# EasyEDA Pro project CameraTargetF4V1.eprj, board PCB1
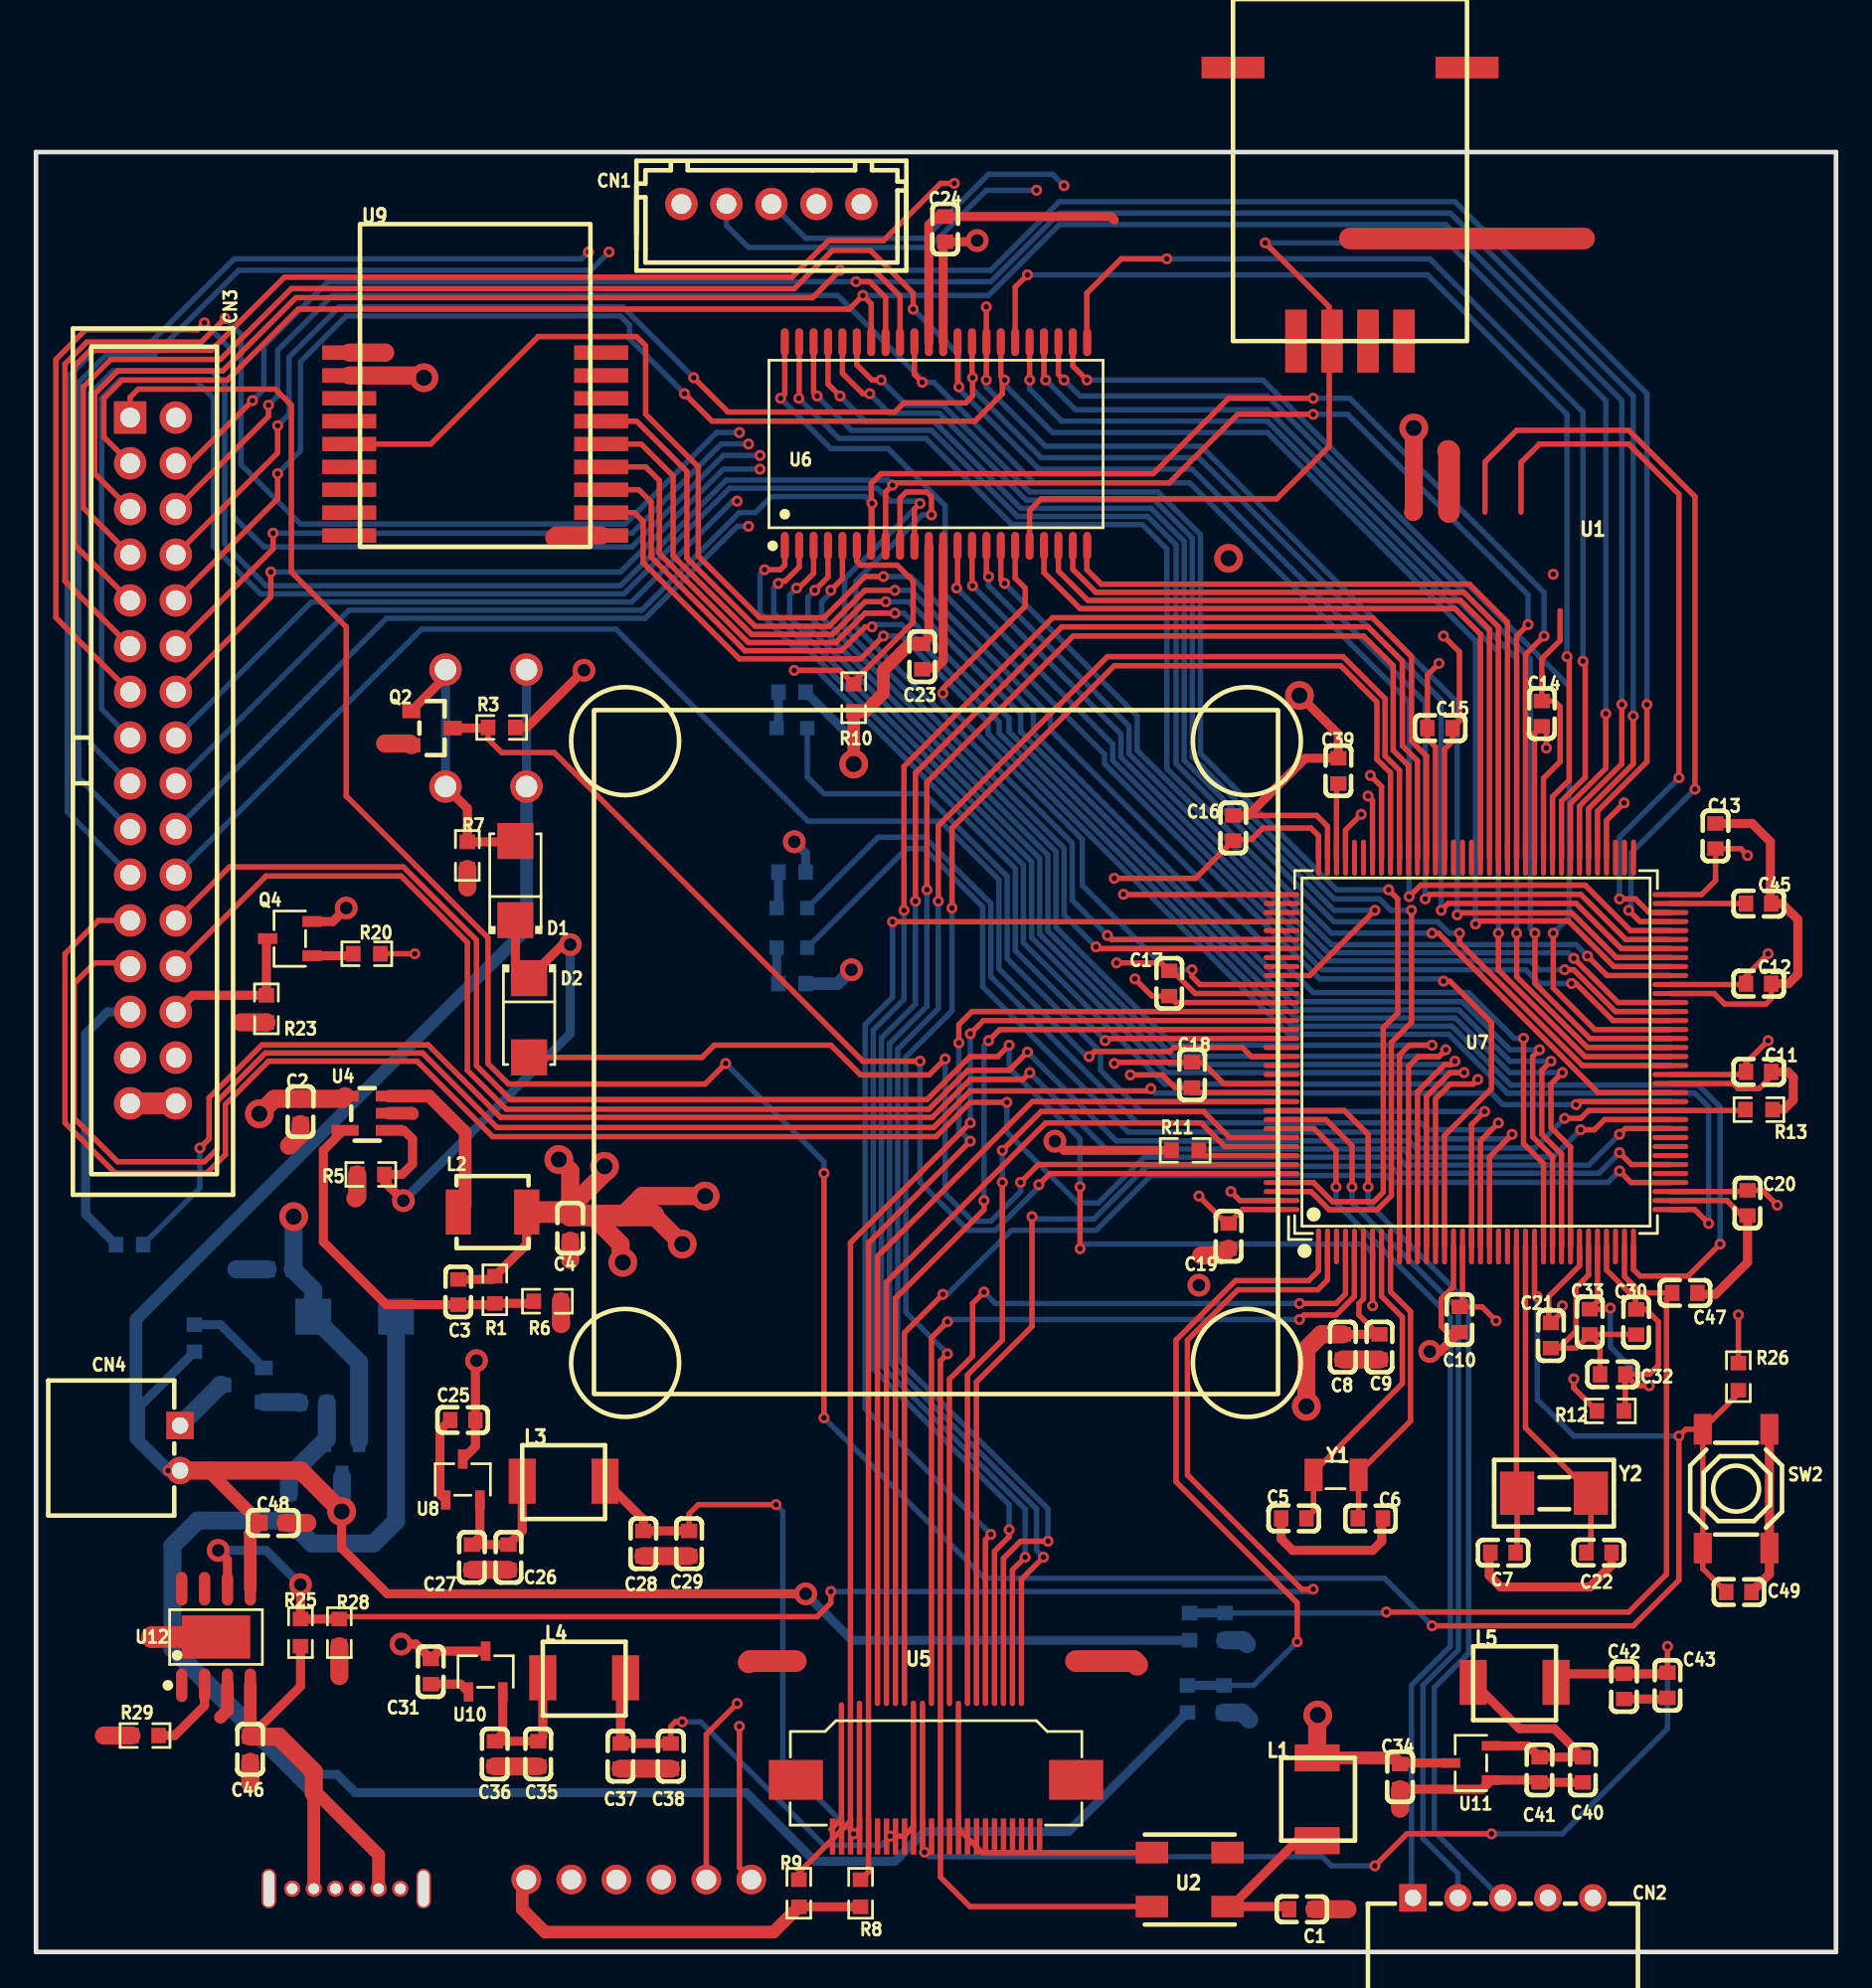
[diagram p1: board, top side]
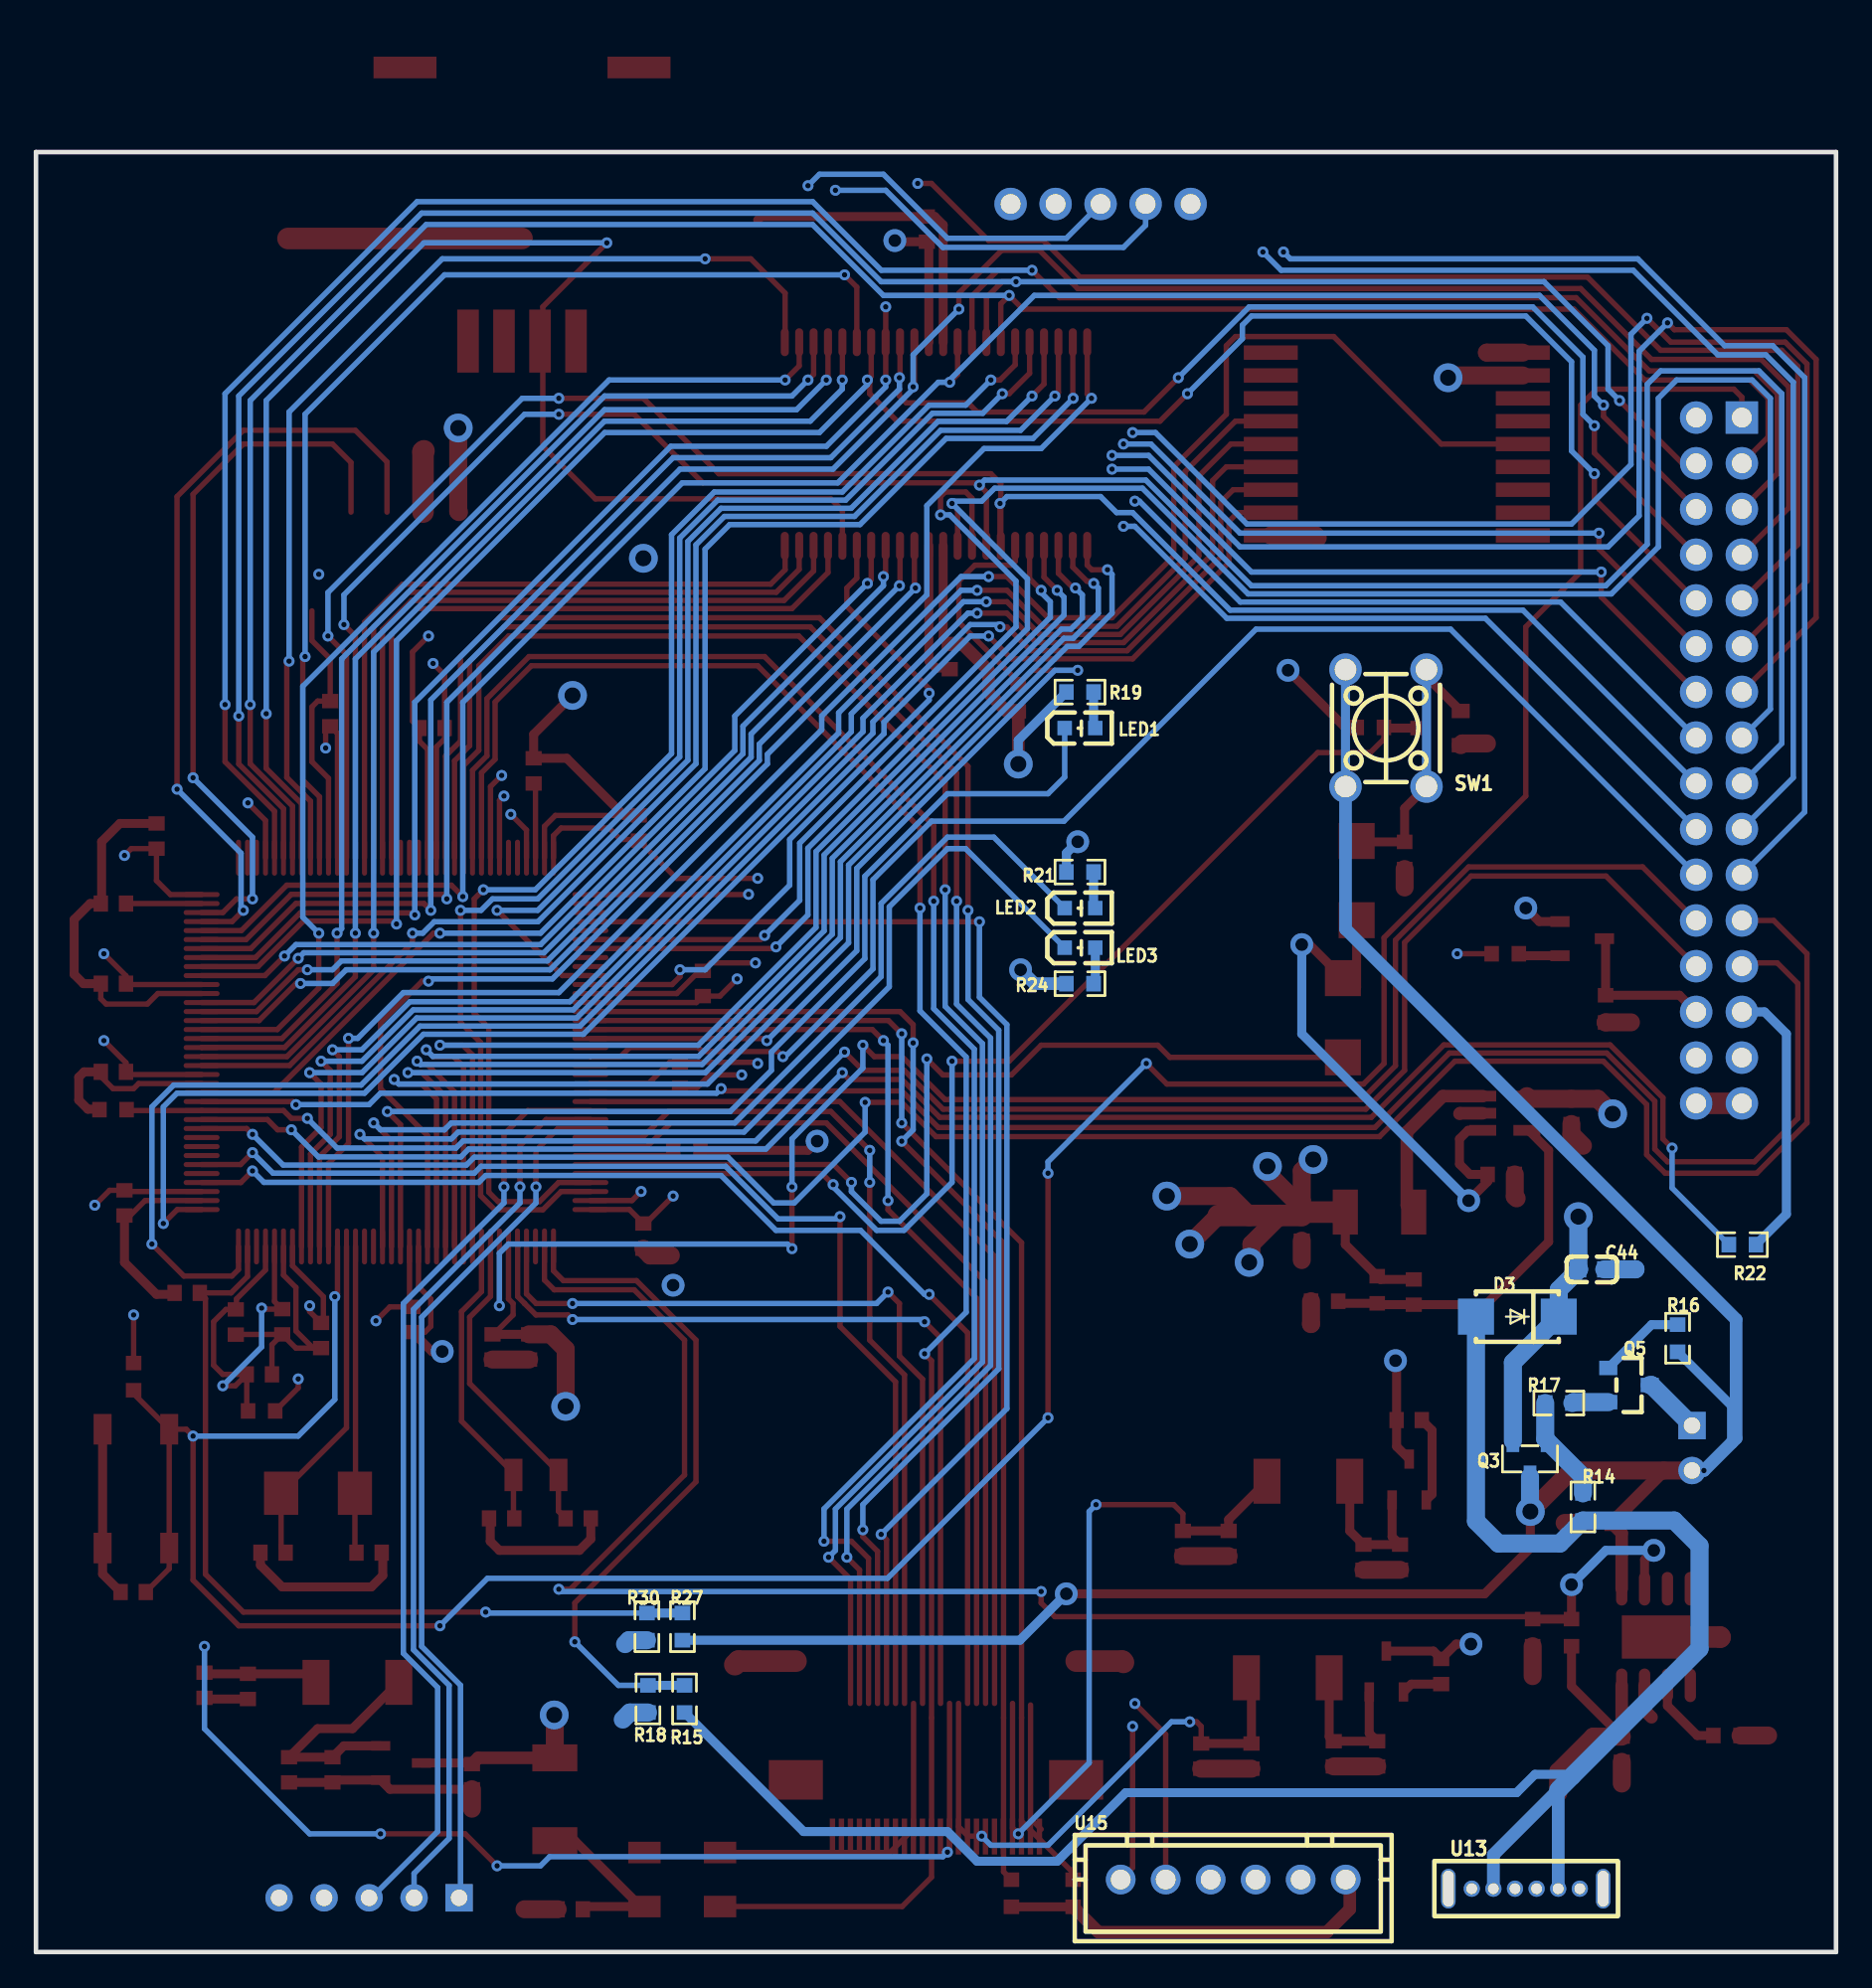
[diagram p2: board, bottom side, seen from below]

Outline 100 x 100 mm; copper layers: Top Layer, CPU1, CPU2, Bottom Layer. Coordinates in mm from the lower left corner of the outline.
Outline path: 0,100 0,0 arc(0,0) 0,0 100,0 arc(100,0) 100,0 100,100 arc(100,100) 100,100 0,100 arc(0,100) 0,100
Stack: Top Layer 0.035mm / Dielectric1 0.48mm PP er 4.5 / CPU1 0.035mm / Dielectric2 0.48mm FR4 er 4.5 / CPU2 0.035mm / Dielectric3 0.48mm PP er 4.5 / Bottom Layer 0.035mm

## Design rules (mm)
spacing safeClearance (default): track to track 0.152, other pairs 0.152 to 0.3
track width trackWidth (default): min 0.127, default 0.254, max 2.54
differential pair differentialPair (default): width min 0.127, default 0.254, max 2.54; gap min 0.152, default 0.152
via viaSize (default): diameter min 0.5, default 0.61, max 10; hole min 0.3, default 0.305, max 6

## Placement (name value [footprint] x y rotation side)
C1  0.1uF  [C0603]  70.32 2.38 180 top
C2  10uF  [C0603]  14.7 46.7 90 top
C3  22pF  [C0603]  23.46 36.67 270 top
C4  10uF  [C0603]  29.68 40.22 90 top
C5  15pF  [C0603]  69.88 24.09 0 top
C6  15pF  [C0603]  74.13 24.09 180 top
C7  22pF  [C0603]  81.5 22.19 180 top
C8  10uF  [C0603]  72.61 33.62 90 top
C9  0.1uF  [C0603]  74.64 33.62 90 top
C10  0.1uF  [C0603]  79.08 35.14 90 top
C11  0.1uF  [C0603]  95.7 48.9 180 top
C12  0.1uF  [C0603]  95.7 53.8 180 top
C13  0.1uF  [C0603]  93.3 62 270 top
C14  0.1uF  [C0603]  83.66 68.8 270 top
C15  0.1uF  [C0603]  78 68 180 top
C16  0.1uF  [C0603]  66.51 62.45 270 top
C17  0.1uF  [C0603]  62.95 53.81 270 top
C18  0.1uF  [C0603]  64.22 48.73 270 top
C19  0.1uF  [C0603]  66.26 39.78 90 top
C20  0.1uF  [C0603]  95.09 41.62 90 top
C21  0.1uF  [C0603]  84.16 34.25 90 top
C22  22pF  [C0603]  86.83 22.19 0 top
C23  0.1uF  [C0603]  49.24 71.97 90 top
C24  0.1uF  [C0603]  50.51 95.72 270 top
C25  1uF  [C0603]  23.71 29.55 0 top
C26  0.1uF  [C0603]  26.25 21.93 90 top
C27  10uF  [C0603]  24.22 21.93 90 top
C28  10uF  [C0603]  33.74 22.7 90 top
C29  0.1uF  [C0603]  36.28 22.7 90 top
C30  0.1uF  [C0603]  88.9 35 90 top
C31  1uF  [C0603]  21.93 15.58 90 top
C32  10uF  [C0603]  87.59 32.09 0 top
C33  2.2uF  [C0603]  86.32 35.01 90 top
C34  1uF  [C0603]  75.78 9.74 90 top
C35  0.1uF  [C0603]  27.9 11.01 90 top
C36  10uF  [C0603]  25.49 11.01 90 top
C37  10uF  [C0603]  32.47 10.88 90 top
C38  0.1uF  [C0603]  35.27 10.88 90 top
C39  2.2uF  [C0603]  72.35 65.62 270 top
C40  0.1uF  [C0603]  85.94 10.12 90 top
C41  10uF  [C0603]  83.53 10.12 90 top
C42  10uF  [C0603]  88.23 14.76 90 top
C43  0.1uF  [C0603]  90.64 14.82 90 top
C44  4.7uF  [C0603]  13.57 37.93 0 bottom
C45  2.2uF  [C0603]  95.7 58.25 180 top
C46  1uF  [C0603]  11.9 11.27 90 top
C47  0.1uF  [C0603]  91.6 36.62 180 top
C48  4.7uF  [C0603]  13.17 23.84 180 top
C49  0.1uF  [C0603]  94.6 20 180 top
CN1  灯板连接口 2.54 5p直插  [CONN-TH_5P-P2.50_HX25003-5A]  40.86 97.12 0 top
CN2  HDGC2501WR-5P  [CONN-TH_5P-P2.50_HDGC2501WR-5P]  81.5 3.01 0 top
CN3  BH-00169  [IDC-TH_BH-00169]  6.5 66.2 270 top
CN4  HDGC2501WR-2P  [CONN-TH_2P-P2.50_HDGC2501WR-2P]  8 28 270 top
D1  SS14A  [SMA_L4.3-W2.6-LS5.2-RD]  26.63 59.53 90 top
D2  SS14A  [SMA_L4.3-W2.6-LS5.2-RD]  27.39 51.91 270 top
D3  -  [DO-214AC_L4.3-W2.7-LS5.3-RD]  17.7 35.3 0 bottom
L1  -  [0420]  69.18 6.19 90 top
L2  2.2uH  [IND-SMD_L4.0-W4.0_0.47UH04209.5A]  25.36 41.11 0 top
L3  -  [0420]  27.01 28.16 0 top
L4  -  [0420]  28.16 17.23 0 top
L5  -  [0420]  79.85 16.98 0 top
LED1  TLMG1100-GS08  [LED0603-R-RD_GREEN]  42 68 180 bottom
LED2  TLMG1100-GS08  [LED0603-R-RD_GREEN]  42 58 180 bottom
LED3  TLMS1000-GS08  [LED0603-R-RD]  42 55.8 180 bottom
Q2  AO3400  [SOT-23_L2.9-W1.3-P1.90-LS2.4-BR]  22 68 180 top
Q3  -  [SOT-23-3_L2.9-W1.3-P1.90-LS2.4-BR]  17 27.4 90 bottom
Q4  SS8550  [SOT-23-3_L2.9-W1.6-P1.90-LS2.8-BR]  14.1 56.3 0 top
Q5  AO3400  [SOT-23_L2.9-W1.3-P1.90-LS2.4-BR]  11.5 31.5 0 bottom
R1  453kΩ  [R0603]  25.49 36.79 90 top
R3  100kΩ  [R0603]  25.87 68.03 0 top
R5  100kΩ  [R0603]  18.6 43.2 0 top
R6  100kΩ  [R0603]  28.41 36.16 180 top
R7  10kΩ  [R0603]  23.97 60.92 270 top
R8  4.7kΩ  [R0603]  45.81 3.26 270 top
R9  4.7kΩ  [R0603]  42.38 3.26 270 top
R10  10kΩ  [R0603]  45.43 69.69 270 top
R11  10kΩ  [R0603]  63.84 44.54 0 top
R12  10Ω  [R0603]  87.47 30.06 180 top
R13  10kΩ  [R0603]  95.72 46.8 0 top
R14  1kΩ  [R0603]  14.06 24.73 270 bottom
R15  20kΩ  [R0603]  63.97 14.06 270 bottom
R16  10kΩ  [R0603]  8.8 34.1 270 bottom
R17  10kΩ  [R0603]  15.4 30.5 0 bottom
R18  30kΩ  [R0603]  66 14.06 90 bottom
R19  510R  [R0603]  42 70 0 bottom
R20  10kΩ  [R0603]  18.38 55.46 180 top
R21  510R  [R0603]  42 60 0 bottom
R22  10kΩ  [R0603]  5.2 39.3 0 bottom
R23  10kΩ  [R0603]  12.8 52.4 270 top
R24  510R  [R0603]  42 53.8 0 bottom
R25  20kΩ  [R0603]  14.69 17.74 270 top
R26  10kΩ  [R0603]  94.58 31.97 270 top
R27  300kΩ  [R0603]  64.09 18.08 270 bottom
R28  30kΩ  [R0603]  16.85 17.74 90 top
R29  3kΩ  [R0603]  6.06 12.03 0 top
R30  100kΩ  [R0603]  66.06 18.08 90 bottom
SW1  -  [按钮开关]  25 68 270 bottom
SW2  1TS001G-2700-1500-CT  [SW-SMD_4P-L5.1-W5.1-P3.70-LS6.5-TL-2]  94.45 25.74 90 top
U1  -  [GC2400-TC010R]  73 99 0 top
U2  -  [5032-4P]  64.1 4.03 180 top
U4  -  [PW2051]  18.4 46.6 0 top
U5  -  [OV2640]  50 16.2 0 top
U6  IS62WV51216BLL-55TLI  [TSOP-44_L18.4-W10.2-P0.80-LS11.8-BL]  50 83.78 0 top
U7  STM32F407ZGT6  [LQFP-144_L20.0-W20.0-P0.50-LS22.0-BL]  80 50 0 top
U8  -  [SOT-23-3_L2.9-W1.6-P1.90-LS2.9-BL]  23.71 26.25 0 top
U9  -  [XY-MBA32A]  18 96 0 top
U10  -  [SOT-23-3_L2.9-W1.6-P1.90-LS2.9-BL]  24.98 15.58 0 top
U11  -  [SOT-23-3_L2.9-W1.6-P1.90-LS2.9-BL]  79.72 10.5 90 top
U12  -  [PW4056]  10 17.5 0 top
U13  -  [typec]  17.23 3.52 180 bottom
U15  HDGC2501WV-6P  [CONN-TH_XH2.54-6P]  33.49 4.03 180 bottom
Y1  -  [3215]  72.23 26.51 180 top
Y2  -  [5032]  84.29 25.49 180 top

## Footprints (pads in the part's own frame, mm; a bottom-side part is the same pattern mirrored in y, then rotated)
0420
  rect 1.5x2.5 smd: 1(0,-2) 2(4.6,-2)
3215
  rect 1x1.8 smd: 1(-1.25,0) 2(1.25,0)
5032
  rect 1.9x2.401 smd: 1(-2.093,0) 2(2.007,0)
5032-4P
  rect 1.8x1.2 smd: 1(-2.1,-1.5) 2(2.1,-1.5) 3(2.1,1.5) 4(-2.1,1.5)
C0603
  rect 0.8x0.899 smd: 1(-0.701,0) 2(0.701,0)
CONN-TH_2P-P2.50_HDGC2501WR-2P
  rect 1.524x1.524 hole 0.914: 1(-1.25,0)
  round 1.524 hole 0.914: 2(1.25,0)
CONN-TH_5P-P2.50_HDGC2501WR-5P
  rect 1.524x1.524 hole 0.914: 1(-5,0)
  round 1.524 hole 0.914: 2(-2.5,0) 3(0,0) 4(2.5,0) 5(5,0)
CONN-TH_5P-P2.50_HX25003-5A
  round 1.8 hole 1.1: 1(-5,0) 2(-2.5,0) 3(0,0) 4(2.5,0) 5(5,0)
CONN-TH_XH2.54-6P
  round 1.65 hole 1.1: 1(-6.25,0) 2(-3.75,0) 3(-1.25,0) 4(1.25,0) 5(3.75,0) 6(6.25,0)
DO-214AC_L4.3-W2.7-LS5.3-RD
  rect 1.999x1.999 smd: 1(-2.299,0) 2(2.301,0)
GC2400-TC010R
  rect 1.2x3.5 smd: 2(-3,-9.5) 3(-1,-9.5) 4(1,-9.5) 5(3,-9.5)
  rect 3.5x1.2 smd: 7(6.5,5.7) 8(-6.5,5.7)
IDC-TH_BH-00169
  rect 1.8x1.8 hole 1.1: 1(-19.05,-1.27)
  round 1.8 hole 1.1: 2(-19.05,1.27) 3(-16.51,-1.27) 4(-16.51,1.27) 5(-13.97,-1.27) 6(-13.97,1.27) 7(-11.43,-1.27) 8(-11.43,1.27) 9(-8.89,-1.27) 10(-8.89,1.27) 11(-6.35,-1.27) 12(-6.35,1.27) 13(-3.81,-1.27) 14(-3.81,1.27) 15(-1.27,-1.27) 16(-1.27,1.27) 17(1.27,-1.27) 18(1.27,1.27) 19(3.81,-1.27) 20(3.81,1.27) 21(6.35,-1.27) 22(6.35,1.27) 23(8.89,-1.27) 24(8.89,1.27) 25(11.43,-1.27) 26(11.43,1.27) 27(13.97,-1.27) 28(13.97,1.27) 29(16.51,-1.27) 30(16.51,1.27) 31(19.05,-1.27) 32(19.05,1.27)
IND-SMD_L4.0-W4.0_0.47UH04209.5A
  rect 1.399x2.499 smd: 1(-1.9,0) 2(1.9,0)
LED0603-R-RD
  rect 0.8x0.8 smd: 1(0.851,0) 2(-0.851,0)
LED0603-R-RD_GREEN
  rect 0.8x0.8 smd: 1(0.851,0) 2(-0.851,0)
LQFP-144_L20.0-W20.0-P0.50-LS22.0-BL
  oval 0.28x2 smd: 1(-8.75,-10.8) 2(-8.25,-10.8) 3(-7.75,-10.8) 4(-7.25,-10.8) 5(-6.75,-10.8) 6(-6.25,-10.8) 7(-5.75,-10.8) 8(-5.25,-10.8) 9(-4.75,-10.8) 10(-4.25,-10.8) 11(-3.75,-10.8) 12(-3.25,-10.8) 13(-2.75,-10.8) 14(-2.25,-10.8) 15(-1.75,-10.8) 16(-1.25,-10.8) 17(-0.75,-10.8) 18(-0.25,-10.8) 19(0.25,-10.8) 20(0.75,-10.8) 21(1.25,-10.8) 22(1.75,-10.8) 23(2.25,-10.8) 24(2.75,-10.8) 25(3.25,-10.8) 26(3.75,-10.8) 27(4.25,-10.8) 28(4.75,-10.8) 29(5.25,-10.8) 30(5.75,-10.8) 31(6.25,-10.8) 32(6.75,-10.8) 33(7.25,-10.8) 34(7.75,-10.8) 35(8.25,-10.8) 36(8.75,-10.8) 73(8.75,10.8) 74(8.25,10.8) 75(7.75,10.8) 76(7.25,10.8) 77(6.75,10.8) 78(6.25,10.8) 79(5.75,10.8) 80(5.25,10.8) 81(4.75,10.8) 82(4.25,10.8) 83(3.75,10.8) 84(3.25,10.8) 85(2.75,10.8) 86(2.25,10.8) 87(1.75,10.8) 88(1.25,10.8) 89(0.75,10.8) 90(0.25,10.8) 91(-0.25,10.8) 92(-0.75,10.8) 93(-1.25,10.8) 94(-1.75,10.8) 95(-2.25,10.8) 96(-2.75,10.8) 97(-3.25,10.8) 98(-3.75,10.8) 99(-4.25,10.8) 100(-4.75,10.8) 101(-5.25,10.8) 102(-5.75,10.8) 103(-6.25,10.8) 104(-6.75,10.8) 105(-7.25,10.8) 106(-7.75,10.8) 107(-8.25,10.8) 108(-8.75,10.8)
  oval 2x0.28 smd: 37(10.8,-8.75) 38(10.8,-8.25) 39(10.8,-7.75) 40(10.8,-7.25) 41(10.8,-6.75) 42(10.8,-6.25) 43(10.8,-5.75) 44(10.8,-5.25) 45(10.8,-4.75) 46(10.8,-4.25) 47(10.8,-3.75) 48(10.8,-3.25) 49(10.8,-2.75) 50(10.8,-2.25) 51(10.8,-1.75) 52(10.8,-1.25) 53(10.8,-0.75) 54(10.8,-0.25) 55(10.8,0.25) 56(10.8,0.75) 57(10.8,1.25) 58(10.8,1.75) 59(10.8,2.25) 60(10.8,2.75) 61(10.8,3.25) 62(10.8,3.75) 63(10.8,4.25) 64(10.8,4.75) 65(10.8,5.25) 66(10.8,5.75) 67(10.8,6.25) 68(10.8,6.75) 69(10.8,7.25) 70(10.8,7.75) 71(10.8,8.25) 72(10.8,8.75) 109(-10.8,8.75) 110(-10.8,8.25) 111(-10.8,7.75) 112(-10.8,7.25) 113(-10.8,6.75) 114(-10.8,6.25) 115(-10.8,5.75) 116(-10.8,5.25) 117(-10.8,4.75) 118(-10.8,4.25) 119(-10.8,3.75) 120(-10.8,3.25) 121(-10.8,2.75) 122(-10.8,2.25) 123(-10.8,1.75) 124(-10.8,1.25) 125(-10.8,0.75) 126(-10.8,0.25) 127(-10.8,-0.25) 128(-10.8,-0.75) 129(-10.8,-1.25) 130(-10.8,-1.75) 131(-10.8,-2.25) 132(-10.8,-2.75) 133(-10.8,-3.25) 134(-10.8,-3.75) 135(-10.8,-4.25) 136(-10.8,-4.75) 137(-10.8,-5.25) 138(-10.8,-5.75) 139(-10.8,-6.25) 140(-10.8,-6.75) 141(-10.8,-7.25) 142(-10.8,-7.75) 143(-10.8,-8.25) 144(-10.8,-8.75)
OV2640
  rect 0.3x2 smd: 1(-5.747,-9.785) 2(-5.247,-9.785) 3(-4.747,-9.785) 4(-4.247,-9.785) 5(-3.747,-9.785) 6(-3.247,-9.785) 7(-2.747,-9.785) 8(-2.247,-9.785) 9(-1.747,-9.785) 10(-1.247,-9.785) 11(-0.747,-9.785) 12(-0.247,-9.785) 13(0.253,-9.785) 14(0.753,-9.785) 15(1.253,-9.785) 16(1.753,-9.785) 17(2.253,-9.785) 18(2.753,-9.785) 19(3.253,-9.785) 20(3.753,-9.785) 21(4.253,-9.785) 22(4.753,-9.785) 23(5.253,-9.785) 24(5.753,-9.785)
  rect 3x2.2 smd: 25(7.785,-6.636) 26(-7.785,-6.636)
PW2051
  rect 1.5x0.6 smd: 1(1.227,-0.95) 2(1.227,0) 3(1.227,0.95) 4(-1.227,0.95) 5(-1.227,-0.95)
PW4056
  oval 0.63x1.865 smd: 1(-1.905,-2.683) 2(-0.635,-2.683) 3(0.635,-2.683) 4(1.905,-2.683) 5(1.905,2.683) 6(0.635,2.683) 7(-0.635,2.683) 8(-1.905,2.683)
  rect 3.8x2.4 smd: 9(0,0)
R0603
  rect 0.807x0.864 smd: 1(-0.754,0) 2(0.754,0)
SMA_L4.3-W2.6-LS5.2-RD
  rect 2x2 smd: 1(-2.2,0) 2(2.2,0)
SOT-23-3_L2.9-W1.3-P1.90-LS2.4-BR
  rect 1.25x0.701 smd: 1(1.001,-0.95) 2(1.001,0.95) 3(-1.001,0)
SOT-23-3_L2.9-W1.6-P1.90-LS2.8-BR
  rect 1.07x0.6 smd: 1(1.235,-0.95) 2(1.235,0.95) 3(-1.235,0)
SOT-23-3_L2.9-W1.6-P1.90-LS2.9-BL
  rect 0.532x1.07 smd: 1(-0.95,-1.135) 2(0.95,-1.135) 3(0,1.135)
SOT-23_L2.9-W1.3-P1.90-LS2.4-BR
  rect 1x0.8 smd: 1(1.15,-0.95) 2(1.15,0.95) 3(-1.15,0)
SW-SMD_4P-L5.1-W5.1-P3.70-LS6.5-TL-2
  rect 1.7x1 smd: 1(-3.3,1.849) 2(3.3,1.851) 3(-3.3,-1.851) 4(3.3,-1.851)
TSOP-44_L18.4-W10.2-P0.80-LS11.8-BL
  oval 0.448x1.551 smd: 1(-8.4,-5.655) 2(-7.6,-5.655) 3(-6.8,-5.655) 4(-6,-5.655) 5(-5.2,-5.655) 6(-4.4,-5.655) 7(-3.6,-5.655) 8(-2.8,-5.655) 9(-2,-5.655) 10(-1.2,-5.655) 11(-0.4,-5.655) 12(0.4,-5.655) 13(1.2,-5.655) 14(2,-5.655) 15(2.8,-5.655) 16(3.6,-5.655) 17(4.4,-5.655) 18(5.2,-5.655) 19(6,-5.655) 20(6.8,-5.655) 21(7.6,-5.655) 22(8.4,-5.655) 23(8.4,5.655) 24(7.6,5.655) 25(6.8,5.655) 26(6,5.655) 27(5.2,5.655) 28(4.4,5.655) 29(3.6,5.655) 30(2.8,5.655) 31(2,5.655) 32(1.2,5.655) 33(0.4,5.655) 34(-0.4,5.655) 35(-1.2,5.655) 36(-2,5.655) 37(-2.8,5.655) 38(-3.6,5.655) 39(-4.4,5.655) 40(-5.2,5.655) 41(-6,5.655) 42(-6.8,5.655) 43(-7.6,5.655) 44(-8.4,5.655)
typec
  round 0.9 hole 0.6: 1(-3,0) 2(-1.8,0) 3(-0.6,0) 4(0.6,0) 5(1.8,0) 6(3,0)
  oval 0.8x2.2 hole 0.6x2: 7(-4.3,0) 8(4.3,0)
XY-MBA32A
  rect 3x0.8 smd: 1(-0.6,-7.14) 2(-0.6,-8.41) 3(-0.6,-9.68) 4(-0.6,-10.95) 5(-0.6,-12.22) 6(-0.6,-13.49) 7(-0.6,-14.76) 8(-0.6,-16.03) 9(-0.6,-17.3) 10(13.4,-17.3) 11(13.4,-16.03) 12(13.4,-14.76) 13(13.4,-13.49) 14(13.4,-12.22) 15(13.4,-10.95) 16(13.4,-9.68) 17(13.4,-8.41) 18(13.4,-7.14)
按钮开关
  round 1.8 hole 1.2: 1(-3.25,2.25) 2(3.25,2.25) 3(-3.25,-2.25) 4(3.25,-2.25)

## Nets
As in the schematic.

Pads without a net: U2 1; U5 1 23 24; U7 3 21 22 34 41 43 44 45 73 74 75 91 92 93 103 104 110 111 113 116 117 126 128 129; U9 3 4 6 7 8 9 16 17 18; U12 1 7 8; U13 3 4 7 8

## Via types
v1: diameter 0.61, hole 0.305, Top Layer to Bottom Layer, 213 vias
v2: diameter 1.27, hole 0.711, Top Layer to Bottom Layer, 15 vias
v3: diameter 1.6, hole 0.9, Top Layer to Bottom Layer, 15 vias

## Routing (per net, layer and track width the routed paths; a pad name or vN(x,y) marks a point on that pad's centre or on a via; arc(x,y) is an arc through that point)
+3.3V: length 806.4
  Top Layer w0.3: v1(77.94,71.59) 77.3,70.95 C15.2 77.3,67.4 77.75,66.95 U7.95 ; v1(96.74,41.49) 95.91,42.32 C20.2 95.02,42.25 U7.39 ; U7.108 71.25,62.02 70.83,62.45 68.16,62.45 67.53,61.81 66.58,61.81 C16.2 64.42,59.65 v1(59.91,59.65) ; v1(96.23,50.64) 95,49.41 C11.2 94.85,48.75 U7.52 ; 64.22,47.78 64.25,47.75 U7.131 ; v1(83.91,66.89) 83.91,67.85 C14.2 83.25,67.7 U7.84 ; C18.2 63.27,48.03 62.57,48.73 v1(60.8,48.73) ; R12.2 85.43,31.34 v1(85.43,31.84) ; U7.62 94.95,53.75 C12.2 95,54.23 v1(96.23,55.46) ; U7.17 79.25,36.01 79.08,35.84 80.34,35.84 v1(81.12,35.07) ; U7.143 66.89,41.75 v1(66.38,42.25) ; v1(61.05,54.06) 62,53.11 C17.2 63.31,52.75 U7.121 ; v1(84.8,35.9) 84.8,35.59 C21.2 84.04,35.08 84.04,36.41 85.75,38.13 U7.30 ; v1(64.61,42) 66.13,40.48 C19.2 67.03,41.25 U7.144 ; U7.72 92.53,58.75 93.31,59.53 93.31,61.29 C13.2 94.71,61.3 v1(95.09,60.92) ; R26.1 v1(94.58,35.4) ; 74.57,34.32 73.5,35.4 73.5,36.03 73.75,36.29 U7.6
  Top Layer w0.5: R3.2 27.27,68.03 v2(30.44,71.21) ; C23.2 49.6,73.03 U6.11 ; U11.3 75.84,10.5 C34.2 ; U8.3 24.41,28.09 C25.2 24.41,32.79 v2(24.47,32.86) ; R9.2 R8.2 ; C24.2 52.22,95.02 v2(52.29,95.09) ; 50.38,95.02 50.4,95 U6.33 ; U10.3 22.37,16.72 C31.2 21.11,17.11 v2(20.28,17.11) ; v2(17.23,58) 16.48,57.25 Q4.2 ; C9.2 C8.2 ; L2.2 27.26,39.32 R1.2 25.31,37.37 C3.1
  Top Layer w0.7: U15.6 27.01,3.8 27.01,2.38 28.28,1.11 40.97,1.11 R9.2 ; v3(45.43,66) R10.2 46.07,68.93 47.08,69.94 47.08,71.21 48.54,72.67 C23.2 ; L1.2 75.44,10.79 C34.2
  Top Layer w1: U9.2 21.43,87.59 v3(21.55,87.47) ; v3(29.05,44.03) 29.68,43.4 29.68,41.75 ; C8.2 71.4,34.32 70.57,33.49 v3(70.57,30.32) ; v3(37.17,42) 33.67,42 32.59,40.92 ; v3(76.54,84.67) 76.54,80.04 76.5,80 ; L1.2 71.18,13.14 v3(71.21,13.17) ; 29.68,41.75 30.06,41.75 31.59,43.27 v3(31.59,43.65) ; 29.68,41.75 C4.2 ; 30.88,40.92 32.47,39.33 32.47,38.44 v3(32.6,38.32) ; v3(35.9,39.33) 34.31,40.92
  Top Layer w1.2: 34.31,40.92 C4.2 29.49,41.11 L2.2 ; CN3.31 CN3.32
  CPU1 w0.3: 98.13,51.79 96.98,50.64 v1(96.23,50.64) ; 98.13,62.46 96.6,60.92 v1(95.09,60.92) ; 61.41,43.03 65.6,43.03 v1(66.38,42.25) ; 98.13,71.36 93.66,66.89 v1(83.91,66.89) ; v1(81.12,35.07) 81.12,32.22 79.21,30.32 ; 83.38,30.32 84.29,31.23 84.29,35.4 v1(84.8,35.9) ; 57.11,49.86 58.36,48.6 60.67,48.6 v1(60.8,48.73) ; v1(94.58,35.4) 94.58,33.49 ; 57.11,55.22 58.27,54.06 v1(61.05,54.06) ; v1(64.61,42) 62.45,42 ; 98.13,72.9 95.81,70.57 78.96,70.57 v1(77.94,71.59) ; 98.13,57.2 97.96,57.2 v1(96.23,55.46) ; v1(59.91,59.65) 58.03,61.53 ; v1(96.74,41.49) 98.13,40.09 ; 85.98,30.32 85.98,30.53 85.43,31.08 v1(85.43,31.84)
  CPU1 w0.5: v2(30.44,71.21) 32.21,72.98 36.17,72.98 ; 26,14.43 23.32,17.11 v2(20.28,17.11) ; 54.7,95.59 54.44,95.34 52.54,95.34 v2(52.29,95.09) ; v2(42.13,61.68) 43.08,61.68 45.3,59.46 ; 20.46,49.49 17.23,52.72 v2(17.23,58) ; v2(24.47,32.86) 27.14,32.86
  CPU1 w0.7: v3(45.43,66) 45.43,63.97 45.81,63.59 47.13,63.59
  CPU1 w1: v3(32.6,38.32) 26,31.71 26,5.27 U15.6 27.14,3.93 27.14,2.25 28.16,1.23 64.48,1.23 71.21,7.96 v3(71.21,13.17) 76.34,13.17 CN2.5 ; v3(76.54,84.67) 78.58,86.7 87.21,86.7 98.13,75.78 98.13,37.05 91.4,30.32 v3(70.57,30.32) 69.18,28.92 46.32,28.92 v3(35.9,39.33) ; CN3.32 8.67,47.15 11.01,49.49 23.58,49.49 v3(29.05,44.03) ; CN1.5 53.18,97.12 60.41,89.88 60.41,71.26 52.74,63.59 ; v3(31.59,43.65) 31.59,58.64 37.17,64.22 37.17,71.97 21.68,87.47 v3(21.55,87.47) ; 52.74,63.59 47.13,63.59 45.3,61.76 v2(45.3,54.57) ; 52.74,63.59 56.35,63.59 58.03,61.91 58.03,59.81 57.11,58.89 57.11,47.33 63.46,40.98 63.46,38.19 62.32,37.05 58.13,37.05 57.11,38.06 41.11,38.06 v3(37.17,42)
  Bottom Layer w0.5: v2(42.13,61.68) 42.75,61.06 R21.2 ; v3(45.43,66) 45.43,67.33 R19.2
  Bottom Layer w0.7: R24.2 44.53,53.8 v2(45.3,54.57)
+3.7V: length 132.3
  Top Layer w0.5: v2(42.76,19.9) 19.52,19.9 16.98,22.44 v3(16.98,24.47)
  Top Layer w0.7: 9.56,26.75 12.47,23.84 11.91,23.27 U12.5
  Top Layer w1: v3(16.98,24.47) 14.7,26.75 CN4.2
  Bottom Layer w0.5: SW1.3 SW1.4 ; R27.2 45.34,17.32 v2(42.76,19.9) ; R16.2 5.8,30.35 5.8,28.28
  Bottom Layer w0.7: SW1.4 27.25,56.84 5.55,35.14 5.55,28.54 v1(7.34,26.75) CN4.2
  Bottom Layer w1: v3(16.98,24.47) 17,24.49 Q3.3
AVDD: length 39.6
  Top Layer w0.3: 36.28,23.4 36.28,24.35 36.79,24.85 v1(41.11,24.85) ; 45.75,13.81 45.75,6.89 v1(45.43,6.57)
  Top Layer w0.5: 36.28,23.4 33.74,23.4 33.74,24.03 L3.2
  Bottom Layer w0.3: v1(45.43,6.57) 41.49,10.5 41.49,24.47 v1(41.11,24.85)
DVDD: length 31.2
  Top Layer w0.3: v1(35.9,12.79) 35.52,12.79 35.27,12.54 C38.2 ; v1(47.46,6.44) 48.22,6.44 48.75,6.96 48.75,13.81
  Top Layer w0.5: C38.2 C37.2 32.47,14.95 L4.2
  Bottom Layer w0.3: v1(47.46,6.44) 46.95,5.93 43.78,5.93 36.92,12.79 v1(35.9,12.79)
GND: length 339.3
  Top Layer w0.3: 51.25,13.81 51.25,6.84 52.56,5.53 U2.2 ; C12.1 96.4,52.97 96.1,52.67 93.82,52.67 93.23,53.25 U7.61 ; v1(78.19,73.11) 79.08,72.23 79.08,68.38 C15.1 78.7,67.27 78.25,66.82 U7.94 ; 44.16,6.82 44.75,7.41 44.75,13.72 ; 84.61,33.55 85.56,34.51 85.56,36.92 86.25,37.61 U7.31 ; 84.61,33.55 C21.1 ; 84.61,33.55 85.56,33.55 C33.1 ; U7.83 83.75,65.21 84.67,66.13 84.67,69.18 84.35,69.5 C14.1 83.66,71.84 84.67,72.86 84.67,74.51 ; U7.130 65.97,48.25 64.79,49.43 C18.1 59.97,49.43 v1(59.91,49.37) ; C11.1 96.4,48.65 95.72,47.97 94.58,47.97 94.3,48.25 U7.51 ; C32.1 86.89,33.74 C33.1 ; C33.1 88.89,34.31 C30.1 ; v1(60.03,54.95) 62.51,54.95 C17.1 63.14,54.51 64.4,53.25 U7.120 ; U7.38 93.94,41.75 94.77,40.92 C20.1 ; U7.107 71.75,62.54 71.14,63.15 67.34,63.15 ; C10.1 78.39,34.44 78.07,34.76 78.07,36.28 78.75,36.97 U7.16
  Top Layer w0.5: C40.1 C41.1 83.4,9.55 U11.1 80.34,9.04 75.78,9.04 ; U6.12 50.4,71.74 50,71.34 49.3,71.34 C23.1 ; 59.91,96.23 59.71,96.42 C24.1 50.07,96.42 49.6,95.96 U6.34 ; C31.1 23.6,14.88 24.03,14.45 ; C43.1 90.58,14.06 C42.1 ; C49.1 96.3,21 SW2.4 ; v2(77.43,33.36) 78.01,33.36 C10.1 ; C5.1 69.18,22.95 69.81,22.31 74.26,22.31 74.77,22.82 74.77,24.03 C6.1 ; C22.2 87.53,21.49 86.32,20.28 81.37,20.28 80.73,20.92 80.73,22.13 C7.2 ; R13.2 96.5,46.83 97.12,46.83 97.63,47.33 97.63,48.6 97.33,48.9 C11.1 ; v2(56.6,45.05) 57.11,44.54 R11.1 ; C25.1 22.44,28.98 22.44,25.44 U8.1 ; C47.1 92.38,36.54 93.31,36.54 95.09,38.32 C20.1 ; C12.1 97.36,53.8 97.88,54.32 97.88,57.37 97,58.25 C45.1 96.36,58.3 96.36,61.68 95.34,62.7 C13.1 ; v3(70.19,69.81) 72.35,67.65 C39.1 70.51,66.32 67.34,63.15 C16.1
  Top Layer w0.7: U12.3 10.64,13.43 10.25,13.04 ; U4.2 20.89,46.6 20.92,46.57
  Top Layer w1: 14.06,44.79 14.7,45.43 C2.1 ; 29.17,34.89 29.16,34.89 R6.1 ; C19.1 65.88,38.7 64.73,38.7 ; C36.1 C35.1 ; U9.1 19.39,88.86 19.39,88.86 ; Q2.2 20.76,67.15 19.39,67.15 ; C27.1 C26.1 ; 17.74,41.87 17.85,41.98 R5.1 ; 75.78,9.04 75.78,7.96 ; R28.1 16.85,15.33 ; C28.1 C29.1 ; R29.1 3.77,12.03 ; C37.1 C38.1 ; C48.1 15.08,23.84 ; C1.1 72.86,2.38 ; C8.1 C9.1 ; 28.79,78.58 28.92,78.7 U9.10 ; 11.39,51.65 12.79,51.65 R23.2 ; R7.2 23.97,59.14 ; C4.1 29.68,38.44 ; C46.1 11.9,9.36
  Top Layer w1.2: U12.9 6.45,17.5 6.44,17.49 ; 42.21,16.16 39.66,16.16 39.59,16.09 ; 78.45,83.4 78.5,83.35 78.5,80 ; 73,95.2 86,95.2 ; 57.78,16.16 60.98,16.16 61.18,15.96
  CPU1 w1: v3(70.19,69.81) 70.19,73.5 v3(66.26,77.43)
  CPU2 w0.254: v1(84.29,76.54) 81.62,76.54 v1(78.19,73.11) ; v1(59.91,49.37) 56.6,46.06 v2(56.6,45.05)
  CPU2 w0.5: v2(64.61,37.05) 64.61,37.43 56.99,45.05 v2(56.6,45.05)
  Bottom Layer w1: 67.27,17.11 67.06,17.32 R30.1 ; 11.14,37.94 11.15,37.93 C44.1 ; 67.4,12.92 67.01,13.3 R18.1 ; Q5.2 14.6,30.55 R17.1
VIN: length 25.7
  Top Layer w1: U4.4 17.02,47.4 C2.2 13.24,47.4 v3(12.41,46.57)
  CPU1 w1: v3(14.31,40.86) 12.41,42.76 v3(12.41,46.57)
  Bottom Layer w1: v3(14.31,40.86) 14.31,37.97 C44.2 15.4,36.8 D3.1 17.95,32.75 Q3.2
ADC_BAT: length 47.8
  Top Layer w0.3: v1(75.02,18.89) 88.48,18.89 90.58,20.99 90.58,36.3 C47.2 89.16,36.62 88.25,37.53 U7.35
  Bottom Layer w0.3: v1(75.02,18.89) 74.97,18.83 R30.2
  Bottom Layer w0.5: R27.1 R30.2
BAT_CHRG: length 37.5
  Top Layer w0.3: v1(70.07,17.23) 70.07,19.39 63.34,26.12 63.34,34 66.64,37.3 70.7,37.3 71.25,37.85 U7.1
  Bottom Layer w0.3: v1(70.07,17.23) 67.65,14.81 R18.2
  Bottom Layer w0.5: R15.1 R18.2
BAT_DONE: length 95.1
  Top Layer w0.3: v1(70.96,20.16) 70.32,20.16 63.97,26.51 63.97,33.99 66.77,36.79 71.21,36.79 71.75,37.33 U7.2 ; v1(44.16,20.03) 44.16,19.39 43.4,18.63 16.99,18.63 R28.2
  Top Layer w0.5: v2(10.12,22.31) 10.64,21.8 U12.6 ; v2(14.69,20.41) R25.1 R28.2
  Bottom Layer w0.3: v1(44.16,20.03) 70.83,20.03 v1(70.96,20.16)
  Bottom Layer w0.5: v2(14.69,20.41) 12.79,22.31 v2(10.12,22.31)
BLE_BRTS: length 83.3
  Top Layer w0.3: U7.27 84.25,44.19 83.15,45.3 83.15,49.75 v1(83.53,50.13) ; U9.15 33.37,85.05 36.16,82.26 36.16,77.45 39.95,73.65 44.05,73.65 46.05,75.65 v1(47.71,75.65)
  Bottom Layer w0.3: v1(47.71,75.65) 48.6,75.65 55.41,68.85 55.41,67.73 70.34,52.8 79.23,52.8 81.9,50.13 v1(83.53,50.13)
BLE_CDS: length 81.9
  Top Layer w0.3: v1(47.71,74.38) 46.06,74.38 44.43,72.75 39.58,72.75 34.63,77.69 34.63,81.75 33.87,82.51 U9.13 ; U7.29 85.25,44.72 84.16,45.81 84.16,48.22 v1(84.8,48.86)
  Bottom Layer w0.3: v1(84.8,48.86) 81.89,48.86 78.85,51.89 69.97,51.89 54.06,67.8 54.06,68.55 48.22,74.38 v1(47.71,74.38)
BLE_LINK: length 82.6
  Top Layer w0.3: U9.14 33.62,83.78 35.4,82 35.4,77.57 39.76,73.2 44.24,73.2 46.06,75.02 v1(47.21,75.02) ; U7.28 84.75,44.33 83.66,45.43 83.66,48.98 v1(84.16,49.49)
  Bottom Layer w0.3: v1(47.21,75.02) 48.48,75.02 54.71,68.79 54.71,67.79 70.15,52.35 79.04,52.35 81.89,49.49 v1(84.16,49.49)
BLE_RST: length 103.4
  Top Layer w0.3: v1(47.08,76.42) 46.06,76.42 43.78,74.13 40.22,74.13 36.79,77.56 36.79,82.51 33.87,85.43 33.87,89.24 33.36,89.75 27.9,89.75 21.93,83.78 U9.5 ; v1(82.64,50.76) 82.64,44.92 83.75,43.81 U7.26
  Bottom Layer w0.3: v1(47.08,76.42) 48.6,76.42 56.35,68.67 56.35,67.91 70.96,53.3 79.59,53.3 82.13,50.76 v1(82.64,50.76)
DCMI_D0: length 100.3
  Top Layer w0.3: v1(54.06,23.46) 54.06,23.08 53.25,22.26 53.25,13.81 ; v1(48.22,57.87) 48.22,65.88 56.48,74.13 74.26,74.13 76.42,71.97 76.42,67.27 77.25,66.44 U7.96
  Bottom Layer w0.3: v1(48.22,57.87) 48.22,52.92 46.52,51.21 46.52,32.4 54.06,24.85 v1(54.06,23.46)
DCMI_D1: length 98.5
  Top Layer w0.3: v1(54.95,21.93) 54.25,21.23 54.25,13.81 ; v1(48.86,58.38) 48.86,65.49 56.99,73.62 74,73.62 75.91,71.72 75.91,67.02 76.75,66.18 U7.97
  Bottom Layer w0.3: v1(54.95,21.93) 54.95,24.61 46.97,32.59 46.97,50.78 48.86,52.67 v1(48.86,58.38)
DCMI_D2: length 97.1
  Top Layer w0.3: v1(49.49,59.02) 49.49,64.99 57.62,73.11 73.75,73.11 75.4,71.46 75.4,66.76 76.25,65.91 U7.98 ; v1(55.97,21.93) 54.75,20.71 54.75,13.81
  Bottom Layer w0.3: v1(55.97,21.93) 55.59,22.31 55.59,24.61 47.42,32.78 47.42,50.47 49.49,52.54 v1(49.49,59.02)
DCMI_D3: length 93.9
  Top Layer w0.3: 53.75,13.81 53.75,21.87 54.7,22.82 v1(56.22,22.82) ; v1(50.13,58.38) 50.13,62.57 59.53,71.97 72.61,71.97 74.95,69.63 74.95,66.45 75.75,65.65 U7.99
  Bottom Layer w0.3: v1(50.13,58.38) 50.13,52.41 47.87,50.16 47.87,32.97 56.22,24.61 v1(56.22,22.82)
DCMI_D4: length 68.7
  Top Layer w0.3: v1(53.05,23.2) 52.75,22.9 52.75,13.81 ; U7.112 69.19,57.24 v1(47.59,57.24)
  Bottom Layer w0.3: v1(47.59,57.24) 47.59,53.05 46.06,51.52 46.06,30.19 v1(53.05,23.2)
DCMI_D5: length 48.5
  Top Layer w0.3: U7.136 66.31,45.25 64.86,46.7 55.84,46.7 v1(53.68,44.54) ; v1(53.68,42.76) 53.68,34 51.75,32.06 51.75,13.81
  Bottom Layer w0.3: v1(53.68,42.76) v1(53.68,44.54)
DCMI_D6: length 46.9
  Top Layer w0.3: 50.75,13.81 50.75,31.82 52.03,33.11 52.03,36.03 v1(52.67,36.67) ; U7.4 72.75,36.56 72.22,36.03 v1(70.19,36.03)
  Bottom Layer w0.3: v1(52.67,36.67) 53.3,36.03 v1(70.19,36.03)
DCMI_D7: length 47.5
  Top Layer w0.3: 49.75,13.81 49.75,34.13 v1(50.64,35.01) ; U7.5 73.24,39.19 73.24,36.42 72.86,36.04 72.86,36.03 72.23,35.4 70.45,35.4 v1(70.19,35.14)
  Bottom Layer w0.3: v1(50.64,35.01) 50.76,35.14 v1(70.19,35.14)
DCMI_HSYNC: length 67.5
  Top Layer w0.3: v1(87.97,43.4) 88.62,42.75 U7.40 ; v1(50.38,36.54) 48.25,34.4 48.25,13.81
  Bottom Layer w0.3: v1(50.38,36.54) 50.64,36.54 54.19,40.09 58.89,40.09 61.94,43.14 75.02,43.14 75.4,42.76 87.34,42.76 v1(87.97,43.4)
DCMI_PXCLK: length 66
  Top Layer w0.3: U7.42 88.64,43.75 v1(87.97,44.41) ; v1(55.33,40.86) 55.33,34.76 52.25,31.67 52.25,13.81
  Bottom Layer w0.3: v1(87.97,44.41) 86.83,43.27 75.65,43.27 75.27,43.65 61.69,43.65 58.77,40.73 55.46,40.73 v1(55.33,40.86)
DCMI_VSYNC: length 49.6
  Top Layer w0.3: 47.25,13.81 47.25,37.21 56.1,46.06 64.73,46.06 66.05,44.75 U7.137
DOVDD: length 65.5
  Top Layer w0.3: v1(90.64,16.98) C43.2 ; v1(80.86,6.57) 76.16,6.57 v1(74.38,4.79) ; 49.25,13.81 49.25,5.67 v1(49.37,5.55)
  Top Layer w0.5: C43.2 90.58,15.46 C42.2 84.92,15.46 L5.2
  Bottom Layer w0.3: v1(80.86,6.57) 84.8,6.57 90.64,12.41 v1(90.64,16.98) ; v1(49.37,5.55) 49.62,5.3 71.46,5.3 71.97,4.79 v1(74.38,4.79)
FSMC_A0: length 63.3
  Top Layer w0.3: U7.10 75.75,49.84 76.29,50.38 v1(77.56,50.38) ; v1(44.16,75.65) 44.8,76.3 U6.5
  Bottom Layer w0.3: v1(77.56,50.38) 63.21,50.38 56.67,56.92 56.67,61.14 43.65,74.15 43.65,75.02 44.16,75.53 v1(44.16,75.65)
FSMC_A1: length 65
  Top Layer w0.3: U7.11 76.25,49.2 76.8,49.75 77.94,49.75 v1(78.32,50.13) ; v1(43.27,75.65) 44,76.39 U6.4
  Bottom Layer w0.3: v1(43.27,75.65) 42.89,75.27 42.89,74.28 56.22,60.95 56.22,56.73 63.19,49.76 77.96,49.76 v1(78.32,50.13)
FSMC_A2: length 65.8
  Top Layer w0.3: U6.3 43.2,76.6 42.38,75.78 v1(42.25,75.78) ; v1(78.83,49.49) 78.65,49.31 78.27,49.31 76.75,47.79 U7.12
  Bottom Layer w0.3: v1(78.83,49.49) 78.65,49.31 63,49.31 55.76,56.55 55.76,60.76 43.03,73.5 42.51,73.5 41.87,74.13 41.87,75.4 v1(42.25,75.78)
FSMC_A3: length 66.8
  Top Layer w0.3: U6.2 42.4,76.94 41.62,76.16 41.36,76.16 v1(41.24,76.04) ; v1(79.34,48.86) 78.57,48.86 77.25,47.54 U7.13
  Bottom Layer w0.3: v1(41.24,76.04) 40.98,75.78 40.98,74.38 42.38,72.99 42.9,72.99 55.31,60.57 55.31,56.36 62.81,48.86 v1(79.34,48.86)
FSMC_A4: length 69.2
  Top Layer w0.3: v1(80.1,48.48) 79.85,48.22 78.58,48.22 77.75,47.4 U7.14 ; v1(40.48,76.8) 41.35,76.8 41.6,77.05 U6.1
  Bottom Layer w0.3: v1(40.48,76.8) 40.22,76.54 40.22,74.38 42.07,72.53 42.71,72.53 54.86,60.39 54.86,56.06 62.7,48.22 79.85,48.22 v1(80.1,48.48)
FSMC_A5: length 73.8
  Top Layer w0.3: v1(41.36,86.32) 41.6,86.56 U6.44 ; U7.15 78.25,45.36 80.86,47.97 80.86,51.62 78.55,53.94 v1(78.19,53.94)
  Bottom Layer w0.3: v1(78.19,53.94) 78.07,54.06 71.31,54.06 59.37,66.01 59.37,66.54 50.51,75.4 50.51,80.35 47.33,83.53 44.16,83.53 v1(41.36,86.32)
FSMC_A6: length 151.4
  Top Layer w0.3: U6.43 42.4,86.34 v1(42.38,86.32) ; v1(77.56,56.6) 77.92,56.6 86.78,47.75 U7.50
  CPU1 w0.3: v1(42.38,86.32) 42.38,87.59 42,87.97 39.59,87.97 33.87,93.69 31.46,93.69 v1(30.7,94.45)
  Bottom Layer w0.3: CN3.21 1.74,63.34 1.74,87.47 3.52,89.24 6.19,89.24 11.01,94.07 30.32,94.07 v1(30.7,94.45) ; v1(77.56,56.6) 71.97,56.6 62.83,65.75 62.83,77.94 61.46,79.31 54.22,79.31 49.44,84.09 44.61,84.09 v1(42.38,86.32)
FSMC_A7: length 73.3
  Top Layer w0.3: U7.53 85.91,49.25 79.08,56.08 v1(79.08,56.6) ; U6.42 43.2,86.65 v1(43.4,86.45)
  Bottom Layer w0.3: v1(43.4,86.45) 45.3,84.54 49.74,84.54 54.53,79.76 61.76,79.76 63.34,78.18 63.34,66.02 72.12,57.24 77.88,57.24 78.51,56.6 v1(79.08,56.6)
FSMC_A8: length 63.9
  Top Layer w0.3: v1(81.24,56.6) 81.24,54.56 86.06,49.75 90.8,49.75 U7.54 ; v1(55.21,87.34) 55.2,87.35 U6.27
  Bottom Layer w0.3: v1(55.21,87.34) 55.21,86.83 56.99,85.05 68.41,85.05 81.24,72.22 v1(81.24,56.6)
FSMC_A9: length 62.5
  Top Layer w0.3: U7.55 90.8,50.25 86.19,50.25 82.26,54.19 v1(82.26,56.6) ; U6.26 56,87.43 v1(56.1,87.34)
  Bottom Layer w0.3: v1(56.1,87.34) 57.75,85.69 68.42,85.69 82.26,71.84 v1(82.26,56.6)
FSMC_A10: length 61.5
  Top Layer w0.3: v1(83.27,56.6) 83.27,53.81 86.33,50.75 U7.56 ; v1(57.11,87.34) 56.8,87.65 U6.25
  Bottom Layer w0.3: v1(83.27,56.6) 83.02,56.86 83.02,71.84 68.41,86.45 58,86.45 v1(57.11,87.34)
FSMC_A11: length 60.9
  Top Layer w0.3: U7.57 86.6,51.25 84.29,53.56 v1(84.29,56.6) ; U6.24 57.6,88.12 v1(58.38,87.34)
  Bottom Layer w0.3: v1(58.38,87.34) 68.16,87.34 85.18,70.32 85.18,57.49 v1(84.29,56.6)
FSMC_A12: length 39
  Top Layer w0.3: U6.22 58.38,78.11 58.38,76.8 59.18,76 79.63,76 81.75,73.88 U7.87
FSMC_A13: length 39.1
  Top Layer w0.3: U7.88 81.24,60.81 81.24,73.63 79.33,75.54 58.87,75.54 57.6,76.82 U6.21
FSMC_A14: length 39.4
  Top Layer w0.3: U7.89 80.75,73.48 79.14,75.09 58.44,75.09 56.8,76.73 U6.20
FSMC_A15: length 39.6
  Top Layer w0.3: U7.90 80.25,73.22 78.83,74.64 58,74.64 56,76.64 U6.19
FSMC_A16: length 81.6
  Top Layer w0.3: v1(87.21,68.8) 87.21,65.76 85.25,63.8 U7.80 ; U6.18 55.2,80.09 55.84,80.73 68.92,80.73 71.84,83.66 71.84,91.4 v1(68.29,94.96)
  Bottom Layer w0.3: v1(87.21,68.8) 87.21,86.2 78.45,94.96 v1(68.29,94.96)
FSMC_A17: length 60
  Top Layer w0.3: U7.81 84.75,63.94 86.07,65.26 86.07,71.59 v1(85.94,71.72) ; U6.23 58.38,89.46 58.38,92.16 60.29,94.07 v1(62.83,94.07)
  Bottom Layer w0.3: v1(85.94,71.72) 85.94,85.56 77.43,94.07 v1(62.83,94.07)
FSMC_A18: length 62.3
  Top Layer w0.3: U6.28 54.4,92.5 v1(55.08,93.18) ; v1(85.05,71.97) 85.18,71.84 85.18,65.11 84.25,64.18 U7.82
  Bottom Layer w0.3: v1(55.08,93.18) 77.31,93.18 85.05,85.43 v1(85.05,71.97)
FSMC_D0: length 110.2
  Top Layer w0.3: v1(46.44,80.48) 46.44,78.17 U6.7 46.4,81.58 46.95,82.13 62.07,82.13 66.26,86.32 v1(70.96,86.32) ; U7.85 82.75,72.08 v1(83.78,73.11)
  Bottom Layer w0.3: CN3.18 17.39,74.55 33.66,74.55 39.08,79.97 39.97,79.97 40.86,80.86 46.06,80.86 v1(46.44,80.48) ; v1(83.78,73.11) 83.78,75.53 72.99,86.32 v1(70.96,86.32)
FSMC_D1: length 139.9
  Top Layer w0.3: U6.8 47.2,81.11 47.71,81.62 62.95,81.62 66.76,85.43 v1(70.96,85.43) ; U7.86 82.26,60.81 82.26,73.11 v1(82.89,73.75)
  Bottom Layer w0.3: v1(82.89,73.75) 82.89,75.4 72.86,85.43 v1(70.96,85.43) ; CN3.17 3.01,67.15 3.01,86.58 4.28,87.85 9.74,87.85 10.49,87.1 10.49,78.21 12.79,75.91 32.47,75.91 38.34,81.78 47.31,81.78 v1(47.59,81.5)
FSMC_D2: length 96.6
  Top Layer w0.3: U6.9 48,80.77 48.35,81.12 49.49,81.12 49.75,80.86 v1(49.75,79.85) ; v1(59.53,56.48) 59.75,56.25 U7.114
  CPU1 w0.3: v1(49.75,79.85) 49.75,81.62 49.24,82.13 41.49,82.13 39.97,80.61 v1(38.95,80.61)
  Bottom Layer w0.3: v1(38.95,80.61) 38.7,80.61 33.09,75 15.3,75 CN3.16 ; v1(49.75,79.85) 49.24,79.85 45.56,76.16 45.56,73.62 57.57,61.61 57.57,58.43 v1(59.53,56.48)
FSMC_D3: length 122.9
  Top Layer w0.3: v1(49.11,80.48) 48.8,80.17 U6.10 ; U7.115 58.98,55.75 v1(58.89,55.84)
  Bottom Layer w0.3: v1(58.89,55.84) 57.12,57.61 57.12,61.32 44.92,73.52 44.92,76.29 v1(49.11,80.48) 48.98,80.61 47.46,80.61 46.74,81.33 38.53,81.33 32.66,75.46 12.48,75.46 9.87,78.07 9.87,86.32 8.85,87.34 4.66,87.34 3.65,86.32 3.65,69.06 CN3.15
FSMC_D4: length 108.1
  Top Layer w0.3: CN3.14 13.04,75.28 v1(13.04,76.67) ; U6.13 51.2,75.84 v1(51.14,75.78) ; U7.58 87.61,51.75 85.55,53.81 v1(85.31,53.81)
  CPU1 w0.3: v1(51.14,75.78) 51.14,81.37 49.82,82.69 41.17,82.69 40.86,82.39 v1(40.22,82.39)
  Bottom Layer w0.3: v1(85.31,53.81) 83.53,53.81 82.77,54.57 71.44,54.57 59.82,66.2 59.82,67.11 v1(51.14,75.78) ; v1(13.04,76.67) 32.47,76.67 38.19,82.39 v1(40.22,82.39)
FSMC_D5: length 142.7
  Top Layer w0.3: v1(52.03,75.91) 52,75.94 U6.14 ; v1(84.93,54.57) 85.43,54.57 87.75,52.25 U7.59 ; v1(9.36,90.51) 8.98,90.13 2.76,90.13 1.11,88.48 1.11,74.14 CN3.13
  CPU1 w0.3: v1(52.03,75.91) 52.03,82 50.89,83.15 v1(40.22,83.15)
  Bottom Layer w0.3: v1(9.36,90.51) 10.94,88.93 10.94,79.79 12.66,78.07 33.11,78.07 38.19,83.15 v1(40.22,83.15) ; v1(52.03,75.91) 60.27,67.67 60.27,66.38 71.59,55.06 83.04,55.06 83.53,54.57 v1(84.93,54.57)
FSMC_D6: length 107.6
  Top Layer w0.3: CN3.12 13.17,77.95 v1(13.17,78.83) ; U6.15 52.8,76.54 v1(52.92,76.42) ; v1(85.43,55.21) 87.89,52.75 U7.60
  CPU1 w0.3: v1(39.59,83.78) 51.65,83.78 52.92,82.51 v1(52.92,76.42)
  Bottom Layer w0.3: v1(85.43,55.21) 85.12,55.52 71.78,55.52 60.72,66.57 60.72,68.11 52.92,75.91 v1(52.92,76.42) ; v1(39.59,83.78) 38.06,83.78 33.11,78.83 v1(13.17,78.83)
FSMC_D7: length 138.2
  Top Layer w0.3: v1(86.2,55.33) 87.28,54.25 U7.63 ; CN3.11 1.61,76.17 1.61,88.23 2.82,89.44 9.18,89.44 v1(10.5,90.77) ; U6.16 53.6,76.25 v1(53.81,76.04)
  CPU1 w0.3: v1(39.08,84.42) 52.16,84.42 53.81,82.77 v1(53.81,76.04)
  Bottom Layer w0.3: v1(86.2,55.33) 85.56,55.97 71.97,55.97 61.18,66.76 61.18,68.67 v1(53.81,76.04) ; v1(10.5,90.77) 11.39,89.88 11.39,82.64 14.69,79.34 32.73,79.34 37.81,84.42 v1(39.08,84.42)
FSMC_D8: length 122.7
  Top Layer w0.3: v1(13.42,82.13) 13.42,80.74 CN3.10 ; v1(79.97,57.11) 80.14,57.28 85.13,57.28 87.66,54.75 U7.64 ; U6.29 53.6,87.55 v1(53.81,87.34) 53.68,87.21 53.68,86.58 52.16,85.05 37.55,85.05 v1(36.03,86.58)
  Bottom Layer w0.3: v1(36.03,86.58) 32.98,89.63 32.98,90.38 32.47,90.89 17.23,90.89 14.69,88.35 14.69,83.4 v1(13.42,82.13) ; v1(79.97,57.11) 79.97,72.85 68.41,84.42 56.48,84.42 53.81,87.08 v1(53.81,87.34)
FSMC_D9: length 139.8
  Top Layer w0.3: v1(52.79,87.34) 52.79,89.43 U6.30 52.79,89.44 v1(52.79,91.4) ; v1(51.02,98.26) 50.25,98.26 47.08,95.09 44.03,95.09 42,93.05 13.81,93.05 9.74,88.99 3.01,88.99 2.12,88.1 2.12,78.2 CN3.9 ; U7.65 87.8,55.25 85.32,57.73 79.07,57.73 v1(78.96,57.62)
  CPU2 w0.3: v1(52.79,91.4) 52.79,92.55 54.32,94.07 54.32,96.61 52.67,98.26 v1(51.02,98.26)
  Bottom Layer w0.3: v1(78.96,57.62) 78.96,69.43 64.73,83.66 56.09,83.66 53.36,86.39 53.36,86.39 52.79,86.96 v1(52.79,87.34)
FSMC_D10: length 117.9
  Top Layer w0.3: U7.66 88.07,55.75 85.56,58.26 78.45,58.26 v1(78.07,57.87) ; CN3.8 13.42,83.28 v1(13.42,84.8) ; U6.31 52,87.5 v1(52.03,87.47) 52.03,86.45 51.65,86.07 48.22,86.07 47.71,85.56 38.44,85.56 v1(36.54,87.47)
  Bottom Layer w0.3: v1(13.42,84.8) 14.06,85.43 14.06,88.61 16.85,91.4 32.6,91.4 v1(36.54,87.47) ; v1(52.03,87.47) 52.03,86.84 55.85,83.02 64.61,83.02 78.07,69.56 v1(78.07,57.87)
FSMC_D11: length 128.3
  Top Layer w0.3: U7.67 88.33,56.25 85.81,58.76 77.43,58.76 v1(77.18,58.51) ; CN3.7 2.63,80.23 2.63,86.96 4.15,88.48 10.25,88.48 14.19,92.42 42.13,92.42 44.25,94.54 46.35,94.54 48.73,92.16 v1(48.73,91.28) ; v1(51.27,86.96) 51.2,87.03 U6.32
  Bottom Layer w0.3: v1(48.73,91.28) 51.27,88.74 51.27,86.84 55.72,82.39 64.22,82.39 77.18,69.43 v1(77.18,58.51)
FSMC_D12: length 113.7
  Top Layer w0.3: CN3.6 12.92,85.32 v1(12.92,85.94) ; v1(76.29,58.64) 76.92,59.27 86.07,59.27 88.59,56.75 U7.68 ; v1(49.24,87.21) 48.8,87.65 U6.35
  Bottom Layer w0.3: v1(76.29,58.64) 76.29,69.43 64.1,81.62 55.46,81.62 49.87,87.21 v1(49.24,87.21) 49.24,87.34 44.54,92.04 16.47,92.04 13.42,88.99 13.42,86.45 v1(12.92,85.94)
FSMC_D13: length 135.7
  Top Layer w0.3: CN3.5 3.26,82.14 3.26,86.58 4.53,87.85 10.38,87.85 14.44,91.91 43.14,91.91 v1(44.67,93.43) 46.57,93.43 48,92.01 U6.36 ; U7.77 86.75,63.38 89.5,66.13 v1(89.5,69.3)
  Bottom Layer w0.3: v1(44.67,93.43) 53.04,93.43 56.85,97.24 78.83,97.24 89.5,86.58 v1(89.5,69.3)
FSMC_D14: length 123.5
  Top Layer w0.3: U6.37 47.2,91.92 46.32,92.8 v1(45.56,92.8) ; v1(12.03,86.2) 8.54,82.71 CN3.4 ; U7.78 86.25,63.52 88.74,66.01 v1(88.74,68.67)
  Bottom Layer w0.3: v1(12.03,86.2) 12.66,86.83 12.66,89.24 16.22,92.8 v1(45.56,92.8) 53.04,92.8 56.85,96.61 78.58,96.61 88.74,86.45 v1(88.74,68.67)
FSMC_D15: length 125.8
  Top Layer w0.3: U7.79 85.75,63.66 88.1,66.01 v1(88.1,69.3) ; U6.38 46.4,91.57 v1(45.94,92.04) 45.17,91.28 14.57,91.28 10.63,87.34 4.79,87.34 3.77,86.32 3.77,84.17 CN3.3
  Bottom Layer w0.3: v1(45.94,92.04) 52.92,92.04 56.86,95.97 78.32,95.97 88.1,86.2 v1(88.1,69.3)
FSMC_NBL0: length 73.7
  Top Layer w0.3: U6.39 45.6,88.18 46.44,87.34 v1(46.95,87.34) ; v1(75.15,59.02) 75.65,58.51 75.65,52.16 74.85,51.35 74.85,42.21 74.32,41.69 72.03,41.69 70.97,42.75 U7.141
  Bottom Layer w0.3: v1(46.95,87.34) 48.35,85.94 50.38,85.94 55.21,81.12 62.32,81.12 64.69,78.74 64.69,66.58 72.26,59.02 v1(75.15,59.02)
FSMC_NBL1: length 76
  Top Layer w0.3: v1(76.42,57.87) 76.42,51.65 75.3,50.53 75.3,42.02 74.51,41.24 71.84,41.24 70.83,42.25 U7.142 ; U6.40 44.8,87.71 45.94,86.58 v1(46.32,86.58)
  Bottom Layer w0.3: v1(76.42,57.87) 75.27,57.87 74.64,58.51 72.13,58.51 64.24,66.4 64.24,78.55 62.13,80.66 55.02,80.66 50.19,85.49 47.4,85.49 v1(46.32,86.58)
FSMC_NE3: length 53.5
  Top Layer w0.3: U7.125 59.51,50.75 v1(59.4,50.64) ; v1(42.13,71.21) 44.66,71.21 R10.1 45.43,70.57 48.73,73.88 48.73,76.16 47.84,77.05 45.81,77.05 45.6,77.26 U6.6
  Bottom Layer w0.3: v1(59.4,50.64) 54.41,55.63 54.41,60.2 43.4,71.21 v1(42.13,71.21)
FSMC_NE4: length 80.2
  Top Layer w0.3: v1(58.51,49.75) 58.79,50.03 62.98,50.03 63.21,50.25 67.02,50.25 67.53,49.75 69.2,49.75 U7.127
  Bottom Layer w0.3: CN3.22 21.42,73.5 32.22,73.5 42.89,62.83 50.25,62.83 53.5,59.58 53.5,54.62 58.38,49.75 v1(58.51,49.75)
FSMC_NOE: length 134
  Top Layer w0.3: v1(44.67,86.45) 44,87.12 U6.41 ; U7.118 70.76,54.25 v1(74.38,57.87)
  CPU1 w0.3: v1(44.67,86.45) 44.67,87.72 43.78,88.61 39.71,88.61 33.87,94.45 v1(31.84,94.45)
  Bottom Layer w0.3: v1(31.84,94.45) 30.82,93.43 11.27,93.43 6.57,88.74 3.9,88.74 2.38,87.21 2.38,65.25 CN3.19 ; v1(44.67,86.45) 46.08,85.04 49.89,85.04 54.72,80.21 61.94,80.21 63.79,78.37 63.79,66.21 72.12,57.87 v1(74.38,57.87)
FSMC_NWE: length 95.9
  Top Layer w0.3: U7.119 64.67,53.75 64.22,54.19 v1(64.22,54.57) ; U6.17 54.4,76.33 54.95,75.78 54.95,74.77 50.38,70.19 v1(50.38,69.94)
  CPU1 w0.3: v1(39.59,79.21) 41.62,81.24 44.29,81.24 50.38,75.15 v1(50.38,69.94)
  Bottom Layer w0.3: v1(50.38,69.94) 50.38,69.56 58.13,61.81 58.13,59.27 62.83,54.57 v1(64.22,54.57) ; v1(39.59,79.21) 38.96,79.21 33.84,74.1 19.48,74.1 CN3.20
KEY_ON: length 63.3
  Top Layer w0.3: v1(55.72,42.63) 56.33,43.25 U7.140 ; v1(49.11,49.49) 45.94,49.49 28.79,66.64 25.87,66.64 25.12,67.39 R3.1
  Top Layer w0.5: R3.1 25.08,68 Q2.3
  Bottom Layer w0.3: v1(55.72,42.63) 55.72,42.51 53.3,40.09 51.78,40.09 49.11,42.76 v1(49.11,49.49)
L_IN: length 133.9
  Top Layer w0.3: v1(74,42.51) 74,45.43 72.68,46.75 U7.133
  CPU1 w0.3: v1(57.11,98.13) 57.11,96.74 72.35,81.5 72.35,45.56 74,43.9 v1(74,42.51)
  Bottom Layer w0.3: v1(57.11,98.13) 56.48,98.77 52.92,98.77 49.37,95.21 42.76,95.21 CN1.3 ; CN2.3 81.37,3.01 77.69,6.69 77.69,14.69 79.59,16.6 79.59,36.03 74,41.62 v1(74,42.51)
L_RCK: length 133.2
  Top Layer w0.3: v1(73.11,42.51) 73.11,44.79 71.66,46.25 U7.134
  CPU1 w0.3: v1(55.59,97.88) 55.59,97.37 71.84,81.12 71.84,43.78 v1(73.11,42.51)
  Bottom Layer w0.3: CN2.2 79,4.37 77.05,6.31 77.05,14.82 79.03,16.79 79.03,35.7 73.11,41.62 v1(73.11,42.51) ; v1(55.59,97.88) 52.79,97.88 49.62,94.7 39.59,94.7 38.36,95.93 CN1.2
L_SCK: length 131.1
  Top Layer w0.3: v1(72.23,42.51) 72.23,44.53 71.01,45.75 U7.135
  CPU1 w0.3: v1(72.23,42.51) 71.34,43.4 71.34,80.86 53.3,98.9 37.55,98.9 35.86,97.2 CN1.1
  Bottom Layer w0.3: v1(72.23,42.51) 72.23,41.62 78.58,35.27 78.58,16.98 76.42,14.82 76.42,3.09 CN2.1
LCD_BL: length 81.9
  Top Layer w0.3: U7.76 87.25,62.87 v1(88.23,63.84) ; v1(21.04,55.46) R20.1
  CPU2 w0.3: v1(21.04,55.46) 23.33,57.75 33.11,57.75 46.32,70.96 73.37,70.96 80.48,63.84 v1(88.23,63.84)
LED_1: length 56.6
  Top Layer w0.3: U7.19 80.25,45.07 v1(81.24,46.06)
  Bottom Layer w0.3: LED2.2 46.79,61.94 49.37,61.94 53.05,58.26 53.05,54.19 61.18,46.06 76.92,46.06 77.31,45.68 80.86,45.68 v1(81.24,46.06)
LED_2: length 57.6
  Top Layer w0.3: U7.20 80.75,44.17 v1(82,45.43)
  Bottom Layer w0.3: LED3.2 48.35,61.3 49.36,61.3 52.6,58.07 52.6,53.63 60.67,45.56 76.54,45.56 76.92,45.17 81.75,45.17 v1(82,45.43)
LED_PWR: length 59.1
  Top Layer w0.3: v1(80.48,46.7) 79.75,45.97 U7.18
  Bottom Layer w0.3: v1(80.48,46.7) 61.43,46.7 59.14,48.98 59.14,50 53.95,55.19 53.95,59.76 49.37,64.35 43.78,64.35 42.85,65.28 LED1.2
MCU_RX1: length 87.5
  Top Layer w0.3: v1(74,64.22) 74.25,63.98 U7.102 ; U15.1 39.08,4.69 v1(39.08,12.54)
  CPU2 w0.3: v1(74,64.22) 73.75,63.97 60.93,63.97 45.56,48.6 45.56,19.01 v1(39.08,12.54) ; U15.1 39.74,5.58
MCU_RX2: length 86.9
  Top Layer w0.3: U9.11 33.24,79.97 33.73,79.48 33.73,77.19 39.08,71.84 45.81,71.84 v1(47.08,73.11) ; v1(92.93,40.48) 92.15,41.25 U7.37
  Bottom Layer w0.3: v1(92.93,40.48) 92.93,46.95 92.16,47.71 81.75,47.71 78.48,50.99 69.59,50.99 52.89,67.69 52.89,68.32 48.1,73.11 v1(47.08,73.11)
MCU_RX3: length 40.1
  Top Layer w0.3: v1(87.97,58.51) 88.86,58.51 89.62,57.75 U7.70 ; 82.5,80 82.5,82.75 83.53,83.78 88.48,83.78 91.28,80.99 v1(91.28,65.24)
  Bottom Layer w0.3: v1(87.97,58.51) 87.97,61.94 v1(91.28,65.24)
MCU_TX1: length 88.9
  Top Layer w0.3: v1(38.95,13.81) 37.24,12.09 U15.2 ; v1(74.13,65.37) 74.75,64.75 U7.101
  CPU2 w0.3: v1(38.95,13.81) 39.21,13.81 45.05,19.65 45.05,48.73 60.87,64.55 73.31,64.55 v1(74.13,65.37)
MCU_TX2: length 94.3
  Top Layer w0.3: v1(93.56,39.33) 91.78,37.55 89.12,37.55 88.75,37.92 U7.36 ; U9.12 33.49,81.24 34.18,80.55 34.18,77.5 39.39,72.3 44.74,72.3 46.06,73.62 v1(46.44,73.62)
  Bottom Layer w0.3: v1(93.56,39.33) 93.56,46.96 92.35,48.17 81.94,48.17 78.66,51.44 69.78,51.44 53.5,67.71 53.5,68.34 48.1,73.75 46.57,73.75 v1(46.44,73.62)
MCU_TX3: length 43.8
  Top Layer w0.3: v1(92.16,64.61) 92.16,80.86 88.48,84.54 82.26,84.54 80.5,82.79 80.5,80 ; v1(88.48,57.87) 89.11,57.25 U7.69
  Bottom Layer w0.3: v1(92.16,64.61) 88.61,61.05 88.61,58 v1(88.48,57.87)
NRST: length 180.5
  Top Layer w0.3: SW2.2 92.6,22.44 92.6,21.3 C49.2 ; SW2.2 91.65,29.04 v1(91.28,28.66) 91.28,20.66 88.74,18.12 v1(77.56,18.12) ; SW2.2 94.58,31.02 R26.2 ; v1(38.32,49.37) 37.17,48.22 26.25,48.22 25.11,49.37 25.11,56.35 17.23,64.22 17.23,73.62 14.19,76.67 14.19,85.94 13.3,86.83 5.68,86.83 5.23,86.38 CN3.1 ; U7.25 83.25,36.56 v1(83.4,36.41) ; v1(43.78,29.68) v1(43.78,43.27)
  Bottom Layer w0.3: v1(83.4,36.41) 83.4,30.7 85.43,28.66 v1(91.28,28.66) ; v1(77.56,18.12) 74.92,20.76 52.69,20.76 v1(43.78,29.68) ; v1(43.78,43.27) 43.78,43.9 v1(38.32,49.37)
OSC32_IN: length 17.8
  Top Layer w0.3: 70.58,24.09 70.98,24.49 Y1.2 70.98,26.65 75.91,31.59 75.91,35.27 74.75,36.43 U7.8
OSC32_OUT: length 16.8
  Top Layer w0.3: C6.2 73.48,24.14 73.48,26.61 76.36,29.5 76.36,35.58 75.25,36.69 U7.9
OSC_IN: length 17.1
  Top Layer w0.3: U7.23 82.25,25.52 Y2.2 82.28,22.27 C7.1
OSC_OUT: length 18.6
  Top Layer w0.3: 86.13,22.19 86.38,22.44 86.38,25.49 82.75,29.12 U7.24
OV_PWDN: length 55.5
  Top Layer w0.3: v1(52.67,41.75) 52.67,41.24 47.75,36.32 47.75,13.81 ; v1(52.92,50.64) 53.54,51.25 U7.124
  Bottom Layer w0.3: v1(52.92,50.64) 52.67,50.38 v1(52.67,41.75)
OV_RESET: length 50.9
  Top Layer w0.3: U7.132 55.35,47.25 46.75,38.65 46.75,13.81
OV_SCL: length 68.5
  Top Layer w0.3: v1(51.27,50.51) 51.27,51.52 52,52.25 U7.122 ; R8.1 46.25,4.46 46.25,39.39 v1(51.91,45.05)
  Bottom Layer w0.3: v1(51.91,45.05) 51.27,45.68 v1(51.27,50.51)
OV_SDA: length 68.5
  Top Layer w0.3: v1(51.91,51.02) 52.64,51.75 U7.123 ; v1(51.91,46.06) 45.25,39.41 45.25,7.27 42.38,4.4 R9.1
  Bottom Layer w0.3: v1(51.91,46.06) v1(51.91,51.02)
OV_XCLK: length 110
  Top Layer w0.3: v1(50.64,33.24) 50.25,32.85 50.25,4.16 51.88,2.53 U2.3 ; v1(50.89,58) 50.89,62.45 59.91,71.46 72.48,71.46 74.5,69.45 74.5,66.27 75.25,65.51 U7.100
  Bottom Layer w0.3: v1(50.64,33.24) 48.33,35.55 48.33,49.72 50.89,52.29 v1(50.89,58)
PWR_EN: length 52.9
  Top Layer w0.3: v1(54.7,42.76) 55.69,43.75 U7.139 ; D2.2 37.01,49.71 37.68,50.38 44.16,50.38 45.81,48.73 49.62,48.73 v1(50.51,49.62)
  Bottom Layer w0.3: v1(54.7,42.76) 54.7,42.25 53.05,40.6 52.03,40.6 50.51,42.13 v1(50.51,49.62)
SW_EN: length 32.4
  Top Layer w0.5: v2(20.41,41.75) 19.35,42.8 R5.2 20.34,43.2 20.92,43.78 20.92,45.17 20.44,45.65 U4.1 ; D1.1 26.63,53.6 26.89,53.6 D2.1 29.26,55.97 v2(29.68,55.97)
  Bottom Layer w0.5: v2(20.41,41.75) 29.68,51.02 v2(29.68,55.97)
SWCLK: length 82.8
  Top Layer w0.3: v1(60.41,58.76) 60.43,58.75 U7.109
  CPU2 w0.3: v1(60.41,58.76) 57.24,58.76 46.57,48.1 46.57,10.12 43.52,7.07 33.74,7.07 32.24,5.57 U15.4
SWDIO: length 93.4
  Top Layer w0.3: v1(73.62,63.21) 72.75,62.34 U7.105
  CPU2 w0.3: v1(73.62,63.21) 60.92,63.21 46.06,48.35 46.06,10.38 43.52,7.84 33.49,7.84 29.74,4.09 U15.5
T_CS: length 94
  Top Layer w0.3: v1(54.06,50.38) 53.43,49.75 51.89,49.75 49.5,47.36 26.35,47.36 24.47,49.24 24.47,56.22 20.41,60.29 10.75,60.29 CN3.24 ; U7.7 74.25,35.91 v1(74.26,35.9) ; v1(58,42.51) v1(58,39.08)
  Bottom Layer w0.3: v1(58,42.51) 58,45.17 54.06,49.11 v1(54.06,50.38) ; v1(74.26,35.9) 74.26,38.82 73.75,39.33 58.26,39.33 v1(58,39.08)
T_MISO: length 103.2
  Top Layer w0.3: CN3.26 12.78,59.78 20.28,59.78 23.97,56.09 23.97,48.98 26.12,46.83 49.6,46.83 51.76,48.98 54.06,48.98 v1(55.08,50) ; R13.1 94.92,46.75 U7.48 86.25,46.75 85.81,46.32 v1(84.93,46.32)
  Bottom Layer w0.3: v1(84.93,46.32) 83.27,44.67 76.67,44.67 76.27,45.06 60.02,45.06 v1(55.08,50)
T_MOSI: length 107.9
  Top Layer w0.3: v1(85.56,47.08) 85.73,47.25 U7.49 ; CN3.25 5.05,54.95 3.26,54.95 2.12,53.81 2.12,46.32 4.53,43.9 9.36,43.9 10.07,44.61 10.07,47.27 12.74,49.94 21.48,49.94 25.62,45.81 49.87,45.81 51.9,47.84 61.81,47.84 v1(61.94,47.97)
  Bottom Layer w0.3: v1(85.56,47.08) 81.5,47.08 80.86,47.71 62.19,47.71 v1(61.94,47.97)
T_PEN: length 97.6
  Top Layer w0.3: v1(55.21,48.86) 54.83,48.48 51.9,48.48 49.79,46.37 25.81,46.37 21.79,50.4 12.55,50.4 9.61,47.46 9.61,45.17 v1(9.11,44.67) ; U7.47 87.14,46.25 86.58,45.68 v1(85.81,45.68)
  Bottom Layer w0.3: R22.2 9.11,42.45 v1(9.11,44.67) ; v1(85.81,45.68) 84.31,44.17 76.4,44.17 75.96,44.61 59.45,44.61 v1(55.21,48.86)
T_SCK: length 116.2
  Top Layer w0.3: CN3.23 3.46,57.31 1.61,55.46 1.61,46.06 4.41,43.27 9.49,43.27 10.52,44.3 10.52,47.09 12.93,49.49 21.17,49.49 25.36,45.3 50,45.3 51.91,47.21 v1(53.94,47.21) ; U7.46 88.3,45.75 v1(87.97,45.43)
  Bottom Layer w0.3: v1(87.97,45.43) 86.27,43.72 76.09,43.72 75.65,44.16 61.56,44.16 59.02,41.62 57.87,41.62 53.94,45.56 v1(53.94,47.21)
USB+: length 136.2
  Top Layer w0.5: 11.91,11.97 14.69,14.76 R25.2
  Top Layer w0.7: C46.2 11.91,11.97 U12.4 ; U13.5 15.43,8.82 15.62,8.82 19.03,5.4 U13.2
  Top Layer w1: 15.43,8.82 15.43,10.02 13.49,11.97 C46.2
  Bottom Layer w0.5: R15.2 57.36,6.69 49.37,6.69 47.71,5.04 43.27,5.04 39.46,8.85 17.74,8.85 16.73,9.87 14.77,9.87 14.67,9.77
  Bottom Layer w0.7: U13.2 19.03,5.4 15.43,9 U13.5
  Bottom Layer w1: D3.2 20,23.94 18.76,22.7 15.34,22.7 R14.2 8.99,23.97 7.58,22.57 7.58,16.85 15.43,9
$1N11070: length 9.8
  Top Layer w0.5: 66.41,2.53 69.47,2.53 C1.2 ; 66.41,2.53 U2.4 ; 66.41,2.53 70.07,6.19 L1.1
$1N20605: length 23.8
  Top Layer w0.3: C32.2 88.29,30.13 R12.1 ; C32.2 88.93,31.46 v1(89.62,31.46) ; C32.2 89.62,32.09 90.13,32.6 90.13,35.01 89.45,35.7 C30.2 ; U7.32 86.75,36.14 86.32,35.72 87.4,35.72 v1(87.47,35.78) ; 88.86,35.7 88.86,36.28 87.25,37.89 U7.33
  Bottom Layer w0.3: v1(89.62,31.46) 87.47,33.62 v1(87.47,35.78)
$1N21732: length 4.2
  Top Layer w0.3: U7.71 C45.2
$1N22015: length 4.2
  Top Layer w0.3: C39.2 72.25,64.82 U7.106
$1N22293: length 4.6
  Top Layer w0.3: 64.61,44.29 64.64,44.25 U7.138
$1N49914: length 4.4
  Top Layer w0.5: U12.2 9.37,13.68 7.71,12.03 R29.2
$1N58921: length 2
  Bottom Layer w0.5: LED1.1 41.25,68.1 R19.1
$1N63388: length 2
  Bottom Layer w0.5: LED2.1 41.25,58.1 R21.1
$1N63497: length 2
  Bottom Layer w0.5: R24.1 41.15,53.9 LED3.1
$1N92764: length 15.4
  Bottom Layer w0.5: R22.1 2.76,40.99 2.76,51.02 3.97,52.23 CN3.27
$1N105168: length 2.3
  Top Layer w0.5: R20.2 17.51,55.35 Q4.1
$1N105530: length 8.6
  Top Layer w0.5: CN3.28 8.69,53.15 R23.1 12.8,56.24 Q4.3
$1N121900: length 8.5
  Top Layer w0.5: U8.2 24.66,23.08 C27.2 C26.2 27.01,23.4 L3.1
$1N139219: length 5.9
  Bottom Layer w1: R17.2 16.15,28.51 Q3.1 14.06,26.41 R14.1
$1N139221: length 4.8
  Bottom Layer w0.5: R16.1 10.25,34.85 Q5.1
$1N139226: length 3.3
  Bottom Layer w1: CN4.1 10.25,31.5 Q5.3
$1N141101: length 9.6
  Top Layer w0.7: U4.3 21.84,47.55 23.84,45.55 23.84,41.49 L2.1
$1N141104: length 20
  Top Layer w0.5: U4.5 17.08,45.65 15.96,44.54 15.96,39.46 19.46,35.96 C3.2 25.42,35.96 R1.1 27.54,36.04 R6.2
$1N161989: length 15.9
  Top Layer w0.5: SW1.1 22.75,70.85 Q2.1 ; 26.63,61.73 26.58,61.68 R7.1 23.97,63.54 SW1.2
  Bottom Layer w0.5: SW1.1 SW1.2
$1N166238: length 9
  Top Layer w0.5: L4.1 28.16,11.97 27.9,11.71 25.49,11.71 25.93,12.15 U10.2
$1N167422: length 13.2
  Top Layer w0.5: L5.1 82.42,12.41 84.36,12.41 C40.2 C41.2 82.9,11.45 U11.2
